# EAGLE schematic SPU_Rev_2.1 (EAGLE 9.6.2)

## Sheet 1 of 4: MCU
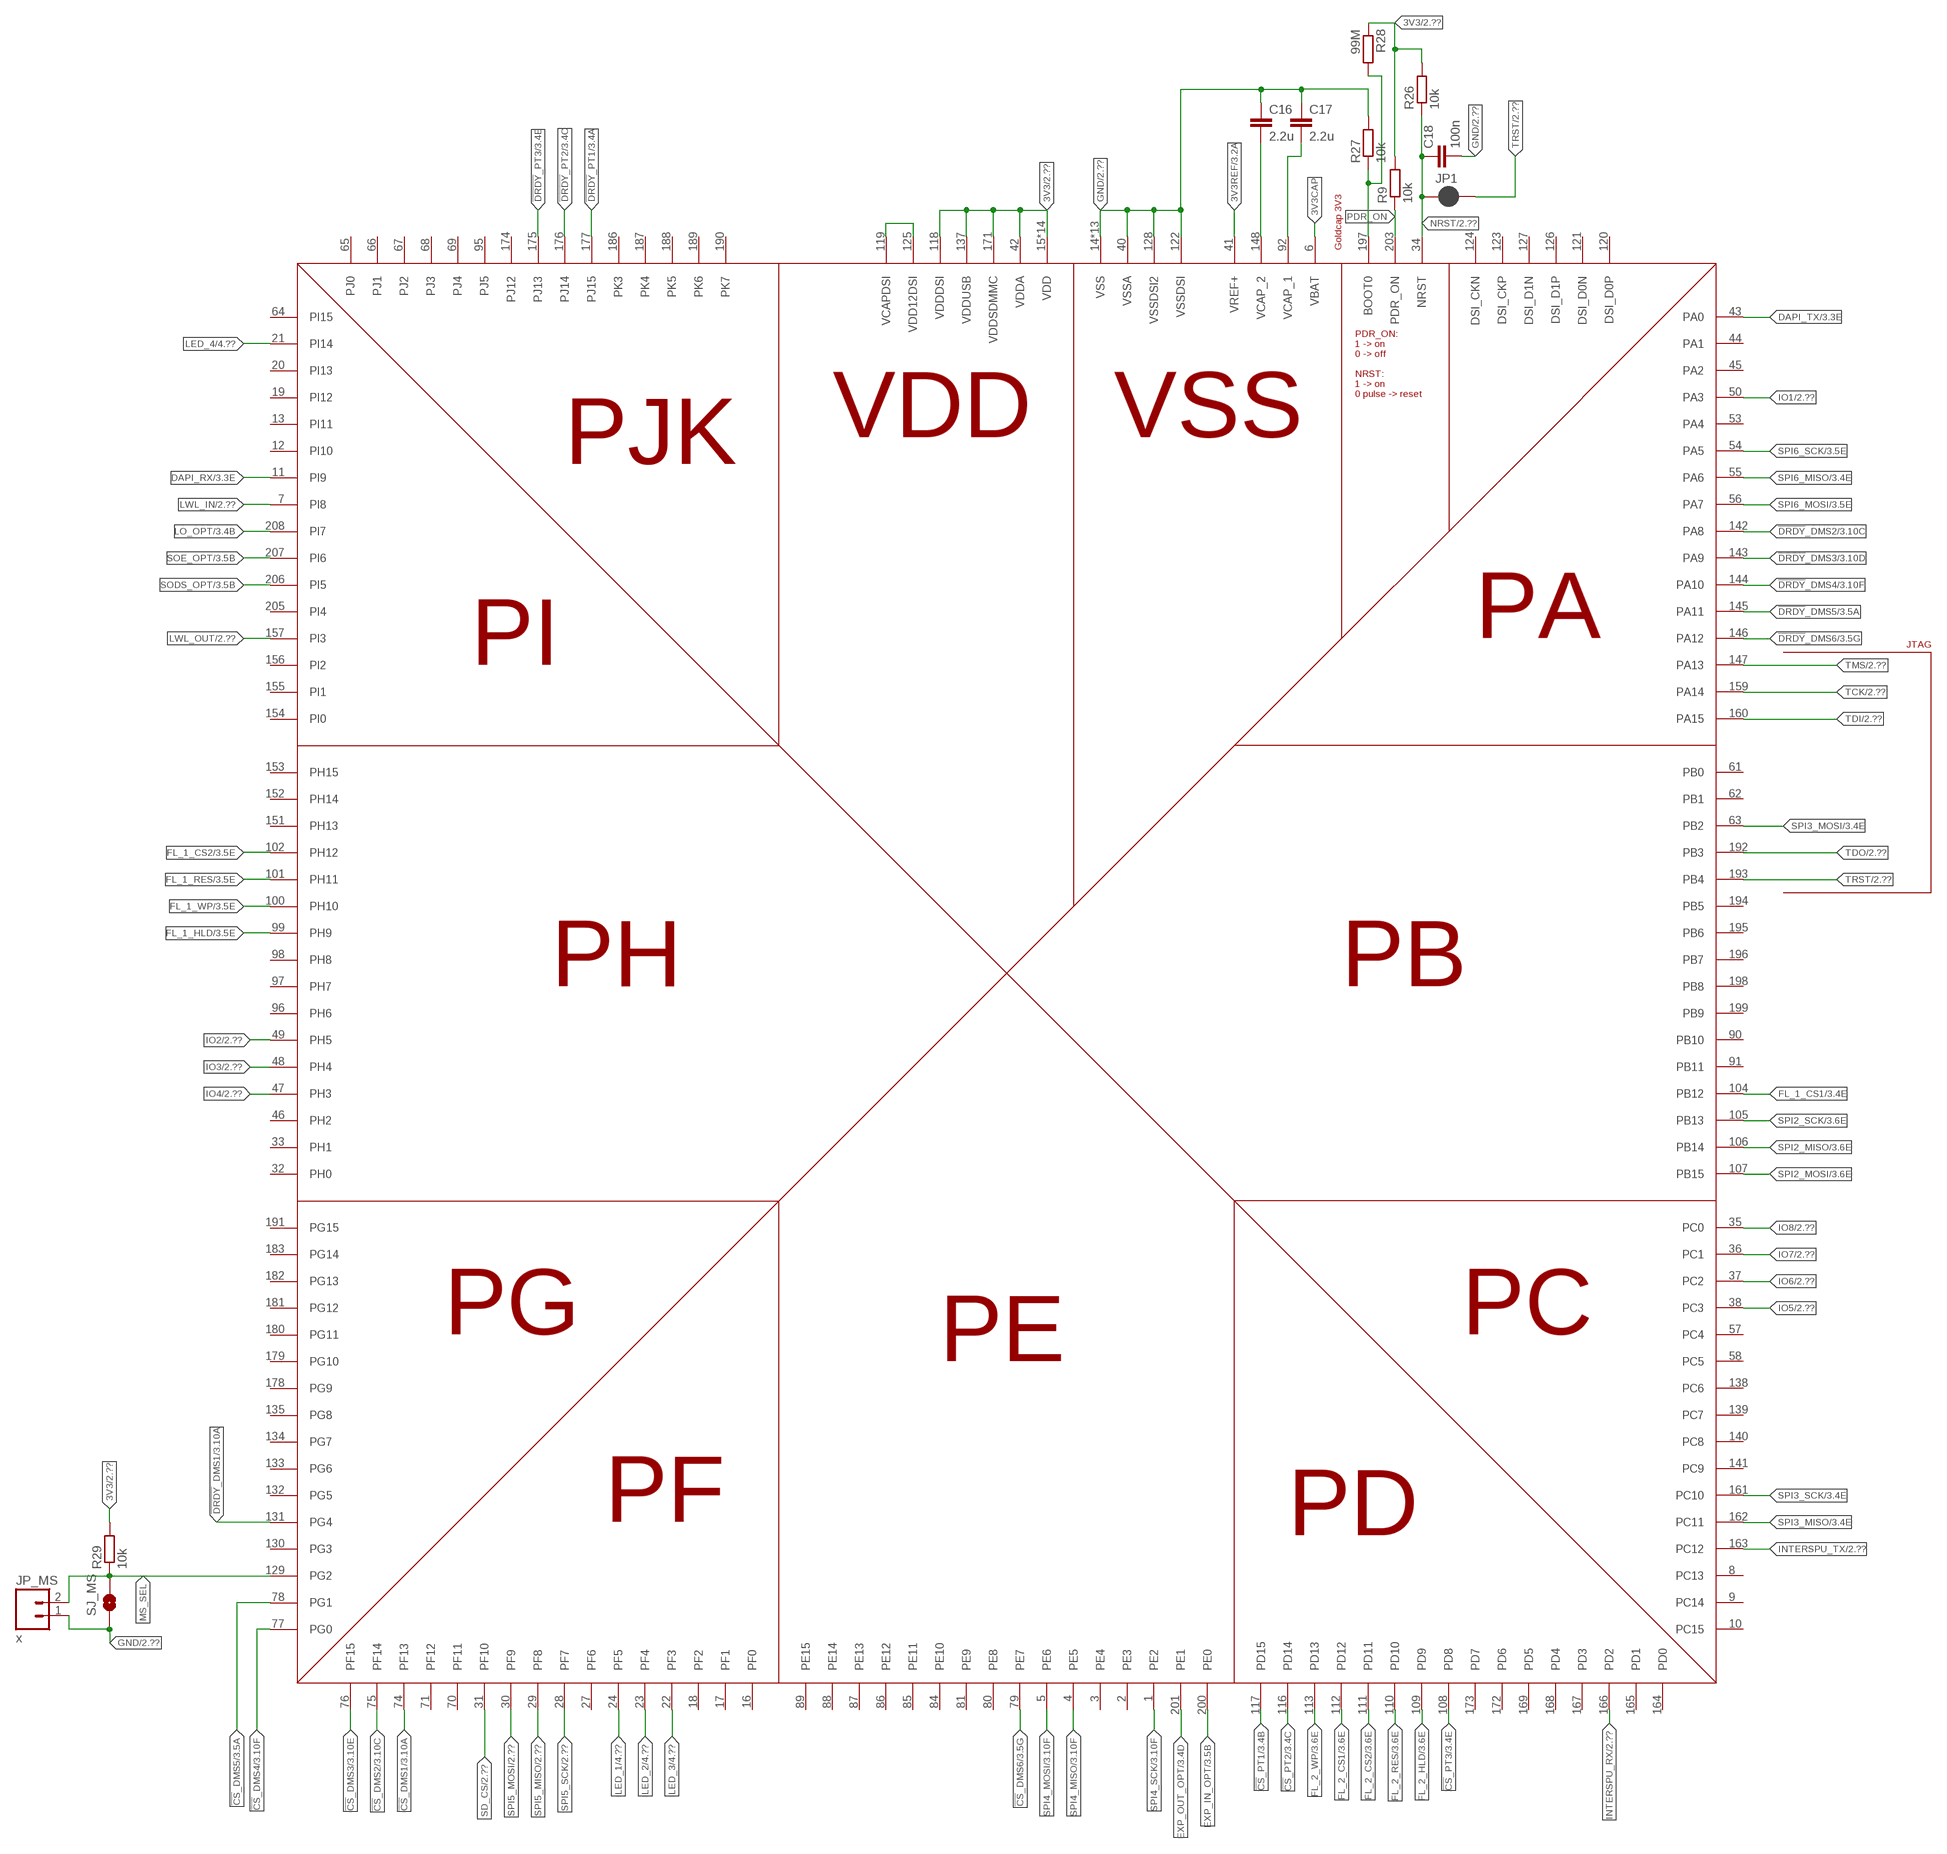
[diagram p0: schematic, sheet 1]

### Parts
C16  2.2u  C-EUC1206  [C1206]
C17  2.2u  C-EUC1206  [C1206]
C18  100n  CAP0603-CAP  [0603-CAP]
JP1  JUMPER-SMT_2_NC_PASTE_SILK  [SMT-JUMPER_2_NC_PASTE_SILK]
JP_MS  x  M02PTH  [1X02]
R9  10k  R-EU_R0805  [R0805]
R26  10k  R-EU_R0805  [R0805]
R27  10k  R-EU_R0805  [R0805]
R28  99M  R-EU_R0805  [R0805]
R29  10k  R-EU_R0805  [R0805]
SJ_MS  SOLDERJUMPERNO  [SJ_2S-NO]
U_STM32F779  STM32F77XXXLQFP208  [QFP50P3060X3060X385-208]

### Nets
3V3: R9.2 R26.2 R28.1 R29.2 U_STM32F779.15(VDD) U_STM32F779.26(VDD) U_STM32F779.39(VDD) U_STM32F779.42(VDDA) U_STM32F779.52(VDD) U_STM32F779.59(VDD) U_STM32F779.73(VDD) U_STM32F779.83(VDD) U_STM32F779.94(VDD) U_STM32F779.103(VDD) U_STM32F779.115(VDD) U_STM32F779.118(VDDDSI) U_STM32F779.137(VDDUSB) U_STM32F779.150(VDD) U_STM32F779.158(VDD) U_STM32F779.171(VDDSDMMC) U_STM32F779.185(VDD) U_STM32F779.204(VDD) ; also sheet 2,3,4
3V3CAP: U_STM32F779.6(VBAT)
3V3REF: U_STM32F779.41(VREF+) ; also sheet 3
!CS!_DMS1: U_STM32F779.74(PF13) ; also sheet 3
!CS!_DMS2: U_STM32F779.75(PF14) ; also sheet 3
!CS!_DMS3: U_STM32F779.76(PF15) ; also sheet 3
!CS!_DMS4: U_STM32F779.77(PG0) ; also sheet 3
!CS!_DMS5: U_STM32F779.78(PG1) ; also sheet 3
!CS!_DMS6: U_STM32F779.79(PE7) ; also sheet 3
!CS!_PT1: U_STM32F779.117(PD15) ; also sheet 3
!CS!_PT2: U_STM32F779.116(PD14) ; also sheet 3
!CS!_PT3: U_STM32F779.108(PD8) ; also sheet 3
!DRDY!_DMS1: U_STM32F779.131(PG4) ; also sheet 3
!DRDY!_DMS2: U_STM32F779.142(PA8) ; also sheet 3
!DRDY!_DMS3: U_STM32F779.143(PA9) ; also sheet 3
!DRDY!_DMS4: U_STM32F779.144(PA10) ; also sheet 3
!DRDY!_DMS5: U_STM32F779.145(PA11) ; also sheet 3
!DRDY!_DMS6: U_STM32F779.146(PA12) ; also sheet 3
!DRDY!_PT1: U_STM32F779.177(PJ15) ; also sheet 3
!DRDY!_PT2: U_STM32F779.176(PJ14) ; also sheet 3
!DRDY!_PT3: U_STM32F779.175(PJ13) ; also sheet 3
DAPI_RX: U_STM32F779.11(PI9) ; also sheet 3
DAPI_TX: U_STM32F779.43(PA0) ; also sheet 3
EXP_IN_OPT: U_STM32F779.200(PE0) ; also sheet 3
EXP_OUT_OPT: U_STM32F779.201(PE1) ; also sheet 3
FL_1_CS1: U_STM32F779.104(PB12) ; also sheet 3
FL_1_CS2: U_STM32F779.102(PH12) ; also sheet 3
FL_1_HLD: U_STM32F779.99(PH9) ; also sheet 3
FL_1_RES: U_STM32F779.101(PH11) ; also sheet 3
FL_1_WP: U_STM32F779.100(PH10) ; also sheet 3
FL_2_CS1: U_STM32F779.112(PD12) ; also sheet 3
FL_2_CS2: U_STM32F779.111(PD11) ; also sheet 3
FL_2_HLD: U_STM32F779.109(PD9) ; also sheet 3
FL_2_RES: U_STM32F779.110(PD10) ; also sheet 3
FL_2_WP: U_STM32F779.113(PD13) ; also sheet 3
GND: C16.1 C17.1 C18.2 JP_MS.1 R27.2 SJ_MS.1 U_STM32F779.14(VSS) U_STM32F779.25(VSS) U_STM32F779.40(VSSA) U_STM32F779.51(VSS) U_STM32F779.60(VSS) U_STM32F779.72(VSS) U_STM32F779.82(VSS) U_STM32F779.93(VSS) U_STM32F779.114(VSS) U_STM32F779.122(VSSDSI) U_STM32F779.128(VSSDSI2) U_STM32F779.136(VSS) U_STM32F779.149(VSS) U_STM32F779.170(VSS) U_STM32F779.184(VSS) U_STM32F779.202(VSS) ; also sheet 2,3,4
INTERSPU_RX: U_STM32F779.166(PD2) ; also sheet 2,3
INTERSPU_TX: U_STM32F779.163(PC12) ; also sheet 2,3
IO1: U_STM32F779.50(PA3) ; also sheet 2
IO2: U_STM32F779.49(PH5) ; also sheet 2
IO3: U_STM32F779.48(PH4) ; also sheet 2
IO4: U_STM32F779.47(PH3) ; also sheet 2
IO5: U_STM32F779.38(PC3) ; also sheet 2
IO6: U_STM32F779.37(PC2) ; also sheet 2
IO7: U_STM32F779.36(PC1) ; also sheet 2
IO8: U_STM32F779.35(PC0) ; also sheet 2
LED_1: U_STM32F779.24(PF5) ; also sheet 4
LED_2: U_STM32F779.23(PF4) ; also sheet 4
LED_3: U_STM32F779.22(PF3) ; also sheet 4
LED_4: U_STM32F779.21(PI14) ; also sheet 4
LO_OPT: U_STM32F779.208(PI7) ; also sheet 3
LWL_IN: U_STM32F779.7(PI8) ; also sheet 2
LWL_OUT: U_STM32F779.157(PI3) ; also sheet 2
MS_SEL: JP_MS.2 R29.1 SJ_MS.2 U_STM32F779.129(PG2)
N$34: C16.2 U_STM32F779.148(VCAP_2)
N$35: C17.2 U_STM32F779.92(VCAP_1)
N$36: U_STM32F779.119(VCAPDSI) U_STM32F779.125(VDD12DSI)
N$71: R27.1 R28.2 U_STM32F779.197(BOOT0)
NRST: C18.1 JP1.1 R26.1 U_STM32F779.34(NRST) ; also sheet 2
PDR_ON: R9.1 U_STM32F779.203(PDR_ON)
SD_CS: U_STM32F779.31(PF10) ; also sheet 2
SODS_OPT: U_STM32F779.206(PI5) ; also sheet 3
SOE_OPT: U_STM32F779.207(PI6) ; also sheet 3
SPI2_MISO: U_STM32F779.106(PB14) ; also sheet 3
SPI2_MOSI: U_STM32F779.107(PB15) ; also sheet 3
SPI2_SCK: U_STM32F779.105(PB13) ; also sheet 3
SPI3_MISO: U_STM32F779.162(PC11) ; also sheet 3
SPI3_MOSI: U_STM32F779.63(PB2) ; also sheet 3
SPI3_SCK: U_STM32F779.161(PC10) ; also sheet 3
SPI4_MISO: U_STM32F779.4(PE5) ; also sheet 3
SPI4_MOSI: U_STM32F779.5(PE6) ; also sheet 3
SPI4_SCK: U_STM32F779.1(PE2) ; also sheet 3
SPI5_MISO: U_STM32F779.29(PF8) ; also sheet 2
SPI5_MOSI: U_STM32F779.30(PF9) ; also sheet 2
SPI5_SCK: U_STM32F779.28(PF7) ; also sheet 2
SPI6_MISO: U_STM32F779.55(PA6) ; also sheet 3
SPI6_MOSI: U_STM32F779.56(PA7) ; also sheet 3
SPI6_SCK: U_STM32F779.54(PA5) ; also sheet 3
TCK: U_STM32F779.159(PA14) ; also sheet 2
TDI: U_STM32F779.160(PA15) ; also sheet 2
TDO: U_STM32F779.192(PB3) ; also sheet 2
TMS: U_STM32F779.147(PA13) ; also sheet 2
TRST: JP1.2 U_STM32F779.193(PB4) ; also sheet 2
Unconnected: U_STM32F779.2(PE3) U_STM32F779.3(PE4) U_STM32F779.8(PC13) U_STM32F779.9(PC14) U_STM32F779.10(PC15) U_STM32F779.12(PI10) U_STM32F779.13(PI11) U_STM32F779.16(PF0) U_STM32F779.17(PF1) U_STM32F779.18(PF2) U_STM32F779.19(PI12) U_STM32F779.20(PI13) U_STM32F779.27(PF6) U_STM32F779.32(PH0) U_STM32F779.33(PH1) U_STM32F779.44(PA1) U_STM32F779.45(PA2) U_STM32F779.46(PH2) U_STM32F779.53(PA4) U_STM32F779.57(PC4) U_STM32F779.58(PC5) U_STM32F779.61(PB0) U_STM32F779.62(PB1) U_STM32F779.64(PI15) U_STM32F779.65(PJ0) U_STM32F779.66(PJ1) U_STM32F779.67(PJ2) U_STM32F779.68(PJ3) U_STM32F779.69(PJ4) U_STM32F779.70(PF11) U_STM32F779.71(PF12) U_STM32F779.80(PE8) U_STM32F779.81(PE9) U_STM32F779.84(PE10) U_STM32F779.85(PE11) U_STM32F779.86(PE12) U_STM32F779.87(PE13) U_STM32F779.88(PE14) U_STM32F779.89(PE15) U_STM32F779.90(PB10) U_STM32F779.91(PB11) U_STM32F779.95(PJ5) U_STM32F779.96(PH6) U_STM32F779.97(PH7) U_STM32F779.98(PH8) U_STM32F779.120(DSI_D0P) U_STM32F779.121(DSI_D0N) U_STM32F779.123(DSI_CKP) U_STM32F779.124(DSI_CKN) U_STM32F779.126(DSI_D1P) U_STM32F779.127(DSI_D1N) U_STM32F779.130(PG3) U_STM32F779.132(PG5) U_STM32F779.133(PG6) U_STM32F779.134(PG7) U_STM32F779.135(PG8) U_STM32F779.138(PC6) U_STM32F779.139(PC7) U_STM32F779.140(PC8) U_STM32F779.141(PC9) U_STM32F779.151(PH13) U_STM32F779.152(PH14) U_STM32F779.153(PH15) U_STM32F779.154(PI0) U_STM32F779.155(PI1) U_STM32F779.156(PI2) U_STM32F779.164(PD0) U_STM32F779.165(PD1) U_STM32F779.167(PD3) U_STM32F779.168(PD4) U_STM32F779.169(PD5) U_STM32F779.172(PD6) U_STM32F779.173(PD7) U_STM32F779.174(PJ12) U_STM32F779.178(PG9) U_STM32F779.179(PG10) U_STM32F779.180(PG11) U_STM32F779.181(PG12) U_STM32F779.182(PG13) U_STM32F779.183(PG14) U_STM32F779.186(PK3) U_STM32F779.187(PK4) U_STM32F779.188(PK5) U_STM32F779.189(PK6) U_STM32F779.190(PK7) U_STM32F779.191(PG15) U_STM32F779.194(PB5) U_STM32F779.195(PB6) U_STM32F779.196(PB7) U_STM32F779.198(PB8) U_STM32F779.199(PB9) U_STM32F779.205(PI4)

### Notes on the sheet
- Goldcap 3V3
- PDR_ON:
  1 -> on
  0 -> off
  
  NRST:
  1 -> on
  0 pulse -> reset
- JTAG

## Sheet 2 of 4: Connectors
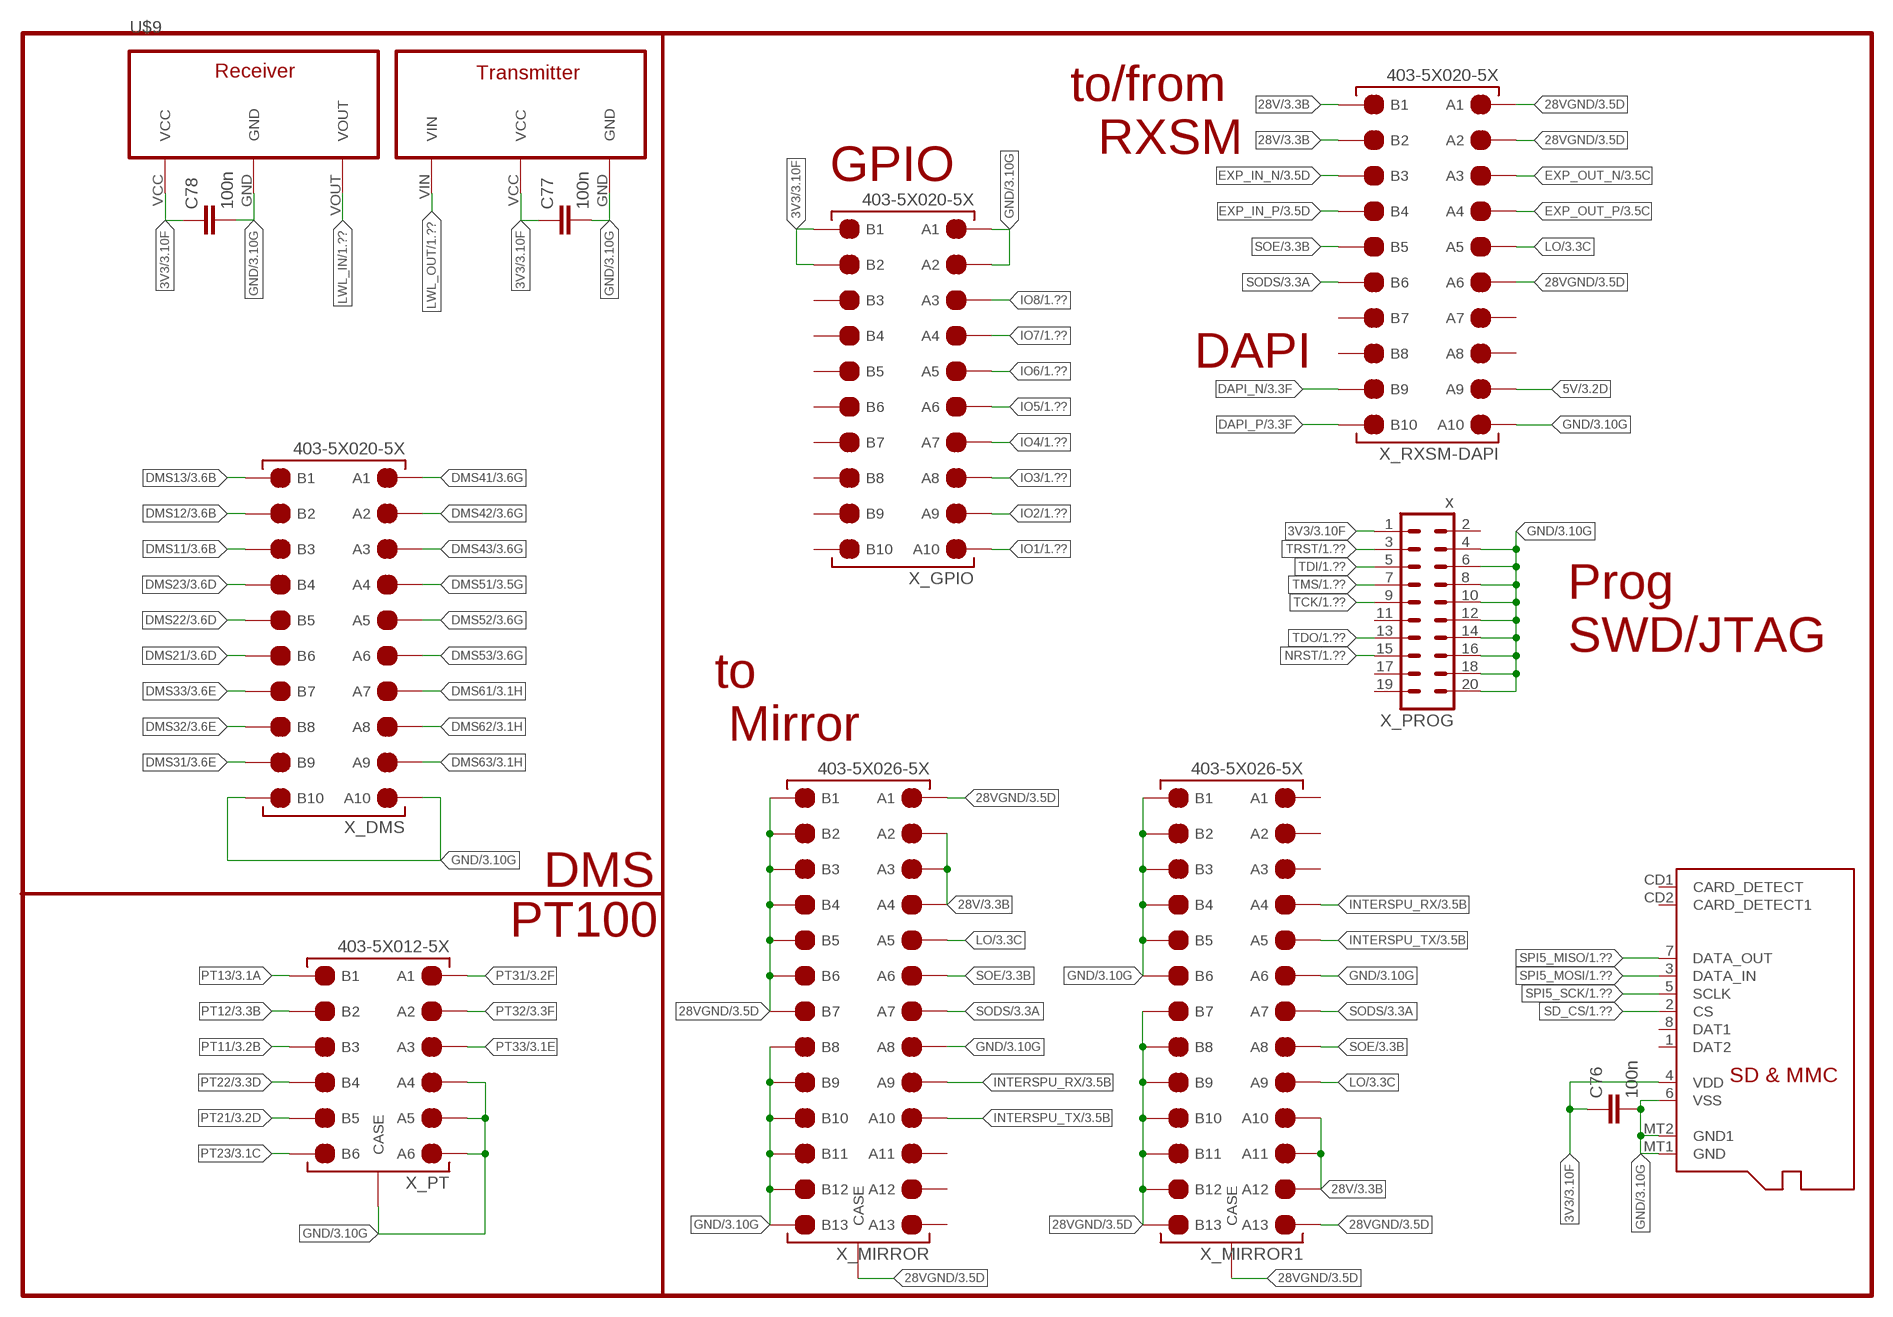
[diagram p1: schematic, sheet 2]

### Parts
C76  100n  CAP0603-CAP  [0603-CAP]
C77  100n  C-EUC1206  [C1206]
C78  100n  C-EUC1206  [C1206]
U$7  MICROSD  [MICROSD]
U$8  PLT131PLT131-T1  [PLT131-T1]
U$9  PLR135  [PLR135-T1]
X_DMS  403-5X020-5X  [403-5X020-5X]
X_GPIO  403-5X020-5X  [403-5X020-5X]
X_MIRROR  403-5X026-5X  [403-5X026-5X]
X_MIRROR1  403-5X026-5X  [403-5X026-5X]
X_PROG  x  MA10-2  [MA10-2]
X_PT  403-5X012-5X  [403-5X012-5X]
X_RXSM-DAPI  403-5X020-5X  [403-5X020-5X]

### Nets
3V3: C76.1 C77.1 C78.1 U$7.4(VDD) U$8.VCC U$9.VCC X_GPIO.P$B1(B1) X_GPIO.P$B2(B2) X_PROG.1 ; also sheet 1,3,4
5V: X_RXSM-DAPI.P$A9(A9) ; also sheet 3,4
28V: X_MIRROR1.P$A10(A10) X_MIRROR1.P$A11(A11) X_MIRROR1.P$A12(A12) X_MIRROR.P$A2(A2) X_MIRROR.P$A3(A3) X_MIRROR.P$A4(A4) X_RXSM-DAPI.P$B1(B1) X_RXSM-DAPI.P$B2(B2) ; also sheet 3,4
28VGND: X_MIRROR1.P$A13(A13) X_MIRROR1.P$B7(B7) X_MIRROR1.P$B8(B8) X_MIRROR1.P$B9(B9) X_MIRROR1.P$B10(B10) X_MIRROR1.P$B11(B11) X_MIRROR1.P$B12(B12) X_MIRROR1.P$B13(B13) X_MIRROR1.P$BL1(CASE) X_MIRROR1.P$BL2(CASE) X_MIRROR1.P$BL3(CASE) X_MIRROR1.P$BL4(CASE) X_MIRROR.P$A1(A1) X_MIRROR.P$B1(B1) X_MIRROR.P$B2(B2) X_MIRROR.P$B3(B3) X_MIRROR.P$B4(B4) X_MIRROR.P$B5(B5) X_MIRROR.P$B6(B6) X_MIRROR.P$B7(B7) X_MIRROR.P$BL1(CASE) X_MIRROR.P$BL2(CASE) X_MIRROR.P$BL3(CASE) X_MIRROR.P$BL4(CASE) X_RXSM-DAPI.P$A1(A1) X_RXSM-DAPI.P$A2(A2) X_RXSM-DAPI.P$A6(A6) ; also sheet 3,4
DAPI_N: X_RXSM-DAPI.P$B9(B9) ; also sheet 3
DAPI_P: X_RXSM-DAPI.P$B10(B10) ; also sheet 3
DMS11: X_DMS.P$B3(B3) ; also sheet 3
DMS12: X_DMS.P$B2(B2) ; also sheet 3
DMS13: X_DMS.P$B1(B1) ; also sheet 3
DMS21: X_DMS.P$B6(B6) ; also sheet 3
DMS22: X_DMS.P$B5(B5) ; also sheet 3
DMS23: X_DMS.P$B4(B4) ; also sheet 3
DMS31: X_DMS.P$B9(B9) ; also sheet 3
DMS32: X_DMS.P$B8(B8) ; also sheet 3
DMS33: X_DMS.P$B7(B7) ; also sheet 3
DMS41: X_DMS.P$A1(A1) ; also sheet 3
DMS42: X_DMS.P$A2(A2) ; also sheet 3
DMS43: X_DMS.P$A3(A3) ; also sheet 3
DMS51: X_DMS.P$A4(A4) ; also sheet 3
DMS52: X_DMS.P$A5(A5) ; also sheet 3
DMS53: X_DMS.P$A6(A6) ; also sheet 3
DMS61: X_DMS.P$A7(A7) ; also sheet 3
DMS62: X_DMS.P$A8(A8) ; also sheet 3
DMS63: X_DMS.P$A9(A9) ; also sheet 3
EXP_IN_N: X_RXSM-DAPI.P$B3(B3) ; also sheet 3
EXP_IN_P: X_RXSM-DAPI.P$B4(B4) ; also sheet 3
EXP_OUT_N: X_RXSM-DAPI.P$A3(A3) ; also sheet 3
EXP_OUT_P: X_RXSM-DAPI.P$A4(A4) ; also sheet 3
GND: C76.2 C77.2 C78.2 U$7.6(VSS) U$7.MT1(GND) U$7.MT2(GND1) U$8.GND U$9.GND X_DMS.P$A10(A10) X_DMS.P$B10(B10) X_GPIO.P$A1(A1) X_GPIO.P$A2(A2) X_MIRROR1.P$A6(A6) X_MIRROR1.P$B1(B1) X_MIRROR1.P$B2(B2) X_MIRROR1.P$B3(B3) X_MIRROR1.P$B4(B4) X_MIRROR1.P$B5(B5) X_MIRROR1.P$B6(B6) X_MIRROR.P$A8(A8) X_MIRROR.P$B8(B8) X_MIRROR.P$B9(B9) X_MIRROR.P$B10(B10) X_MIRROR.P$B11(B11) X_MIRROR.P$B12(B12) X_MIRROR.P$B13(B13) X_PROG.4 X_PROG.6 X_PROG.8 X_PROG.10 X_PROG.12 X_PROG.14 X_PROG.16 X_PROG.18 X_PROG.20 X_PT.P$A4(A4) X_PT.P$A5(A5) X_PT.P$A6(A6) X_PT.P$BL1(CASE) X_PT.P$BL2(CASE) X_PT.P$BL3(CASE) X_PT.P$BL4(CASE) X_RXSM-DAPI.P$A10(A10) ; also sheet 1,3,4
INTERSPU_RX: X_MIRROR1.P$A4(A4) X_MIRROR.P$A9(A9) ; also sheet 1,3
INTERSPU_TX: X_MIRROR1.P$A5(A5) X_MIRROR.P$A10(A10) ; also sheet 1,3
IO1: X_GPIO.P$A10(A10) ; also sheet 1
IO2: X_GPIO.P$A9(A9) ; also sheet 1
IO3: X_GPIO.P$A8(A8) ; also sheet 1
IO4: X_GPIO.P$A7(A7) ; also sheet 1
IO5: X_GPIO.P$A6(A6) ; also sheet 1
IO6: X_GPIO.P$A5(A5) ; also sheet 1
IO7: X_GPIO.P$A4(A4) ; also sheet 1
IO8: X_GPIO.P$A3(A3) ; also sheet 1
LO: X_MIRROR1.P$A9(A9) X_MIRROR.P$A5(A5) X_RXSM-DAPI.P$A5(A5) ; also sheet 3
LWL_IN: U$9.VOUT ; also sheet 1
LWL_OUT: U$8.VIN ; also sheet 1
NRST: X_PROG.15 ; also sheet 1
PT11: X_PT.P$B3(B3) ; also sheet 3
PT12: X_PT.P$B2(B2) ; also sheet 3
PT13: X_PT.P$B1(B1) ; also sheet 3
PT21: X_PT.P$B5(B5) ; also sheet 3
PT22: X_PT.P$B4(B4) ; also sheet 3
PT23: X_PT.P$B6(B6) ; also sheet 3
PT31: X_PT.P$A1(A1) ; also sheet 3
PT32: X_PT.P$A2(A2) ; also sheet 3
PT33: X_PT.P$A3(A3) ; also sheet 3
SD_CS: U$7.2(CS) ; also sheet 1
SODS: X_MIRROR1.P$A7(A7) X_MIRROR.P$A7(A7) X_RXSM-DAPI.P$B6(B6) ; also sheet 3
SOE: X_MIRROR1.P$A8(A8) X_MIRROR.P$A6(A6) X_RXSM-DAPI.P$B5(B5) ; also sheet 3
SPI5_MISO: U$7.7(DATA_OUT) ; also sheet 1
SPI5_MOSI: U$7.3(DATA_IN) ; also sheet 1
SPI5_SCK: U$7.5(SCLK) ; also sheet 1
TCK: X_PROG.9 ; also sheet 1
TDI: X_PROG.5 ; also sheet 1
TDO: X_PROG.13 ; also sheet 1
TMS: X_PROG.7 ; also sheet 1
TRST: X_PROG.3 ; also sheet 1
Unconnected: U$7.1(DAT2) U$7.8(DAT1) U$7.CD1(CARD_DETECT) U$7.CD2(CARD_DETECT1) X_GPIO.P$B3(B3) X_GPIO.P$B4(B4) X_GPIO.P$B5(B5) X_GPIO.P$B6(B6) X_GPIO.P$B7(B7) X_GPIO.P$B8(B8) X_GPIO.P$B9(B9) X_GPIO.P$B10(B10) X_MIRROR1.P$A1(A1) X_MIRROR1.P$A2(A2) X_MIRROR1.P$A3(A3) X_MIRROR.P$A11(A11) X_MIRROR.P$A12(A12) X_MIRROR.P$A13(A13) X_PROG.2 X_PROG.11 X_PROG.17 X_PROG.19 X_RXSM-DAPI.P$A7(A7) X_RXSM-DAPI.P$A8(A8) X_RXSM-DAPI.P$B7(B7) X_RXSM-DAPI.P$B8(B8)

### Notes on the sheet
- to/from
    RXSM
- GPIO
- DAPI
- Prog
  SWD/JTAG
- to 
   Mirror
- DMS
- PT100

## Sheet 3 of 4: IC
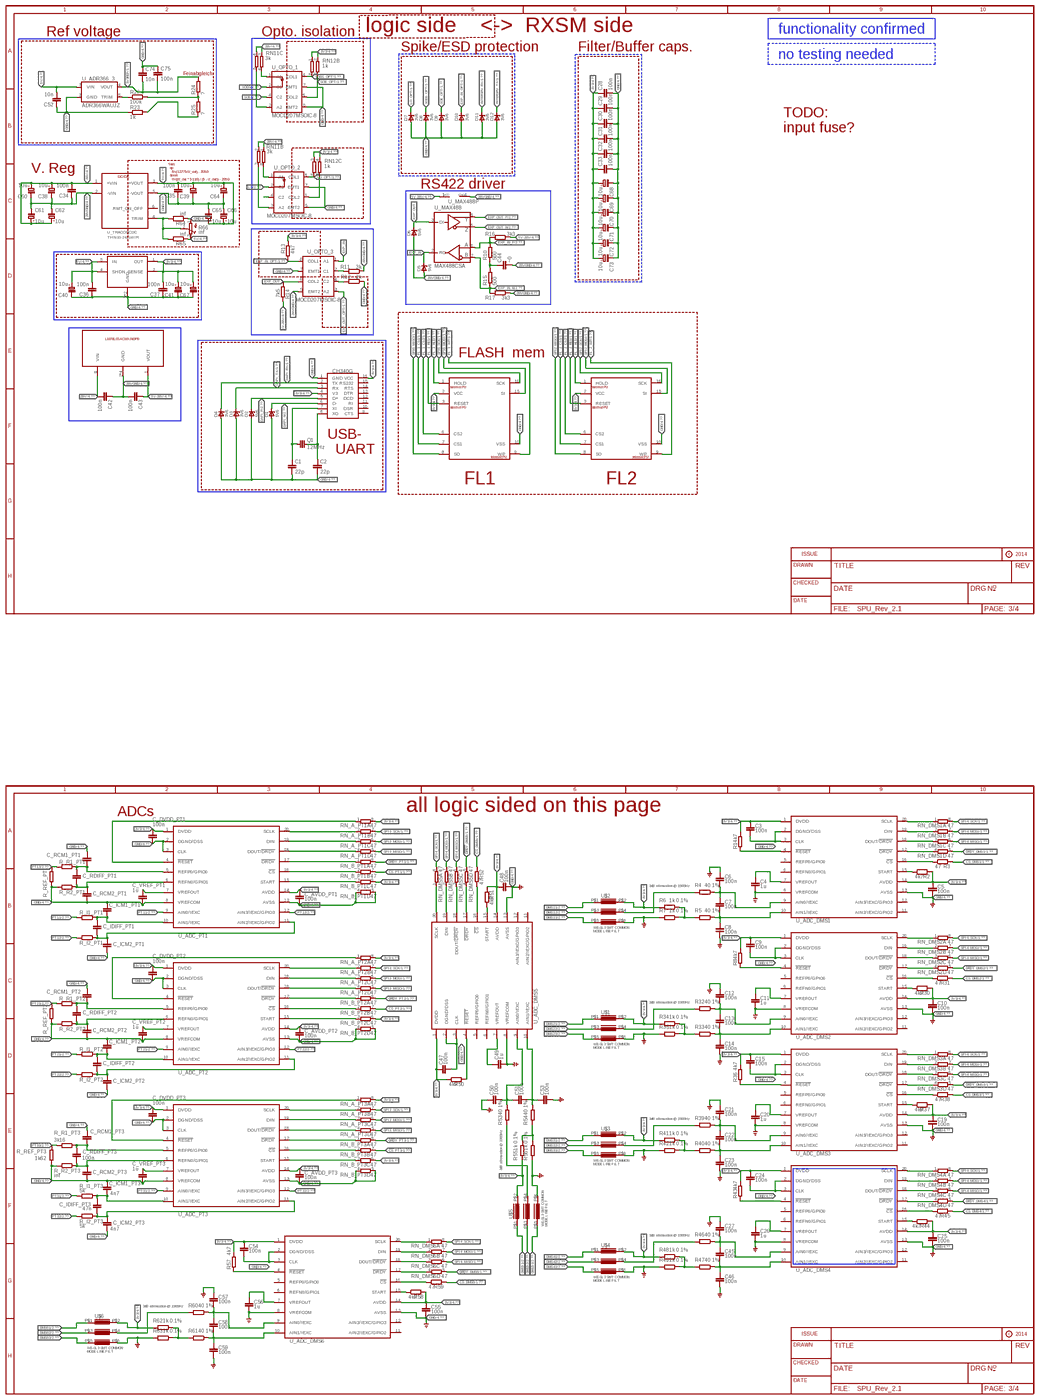
[diagram p2: schematic, sheet 3, overview]
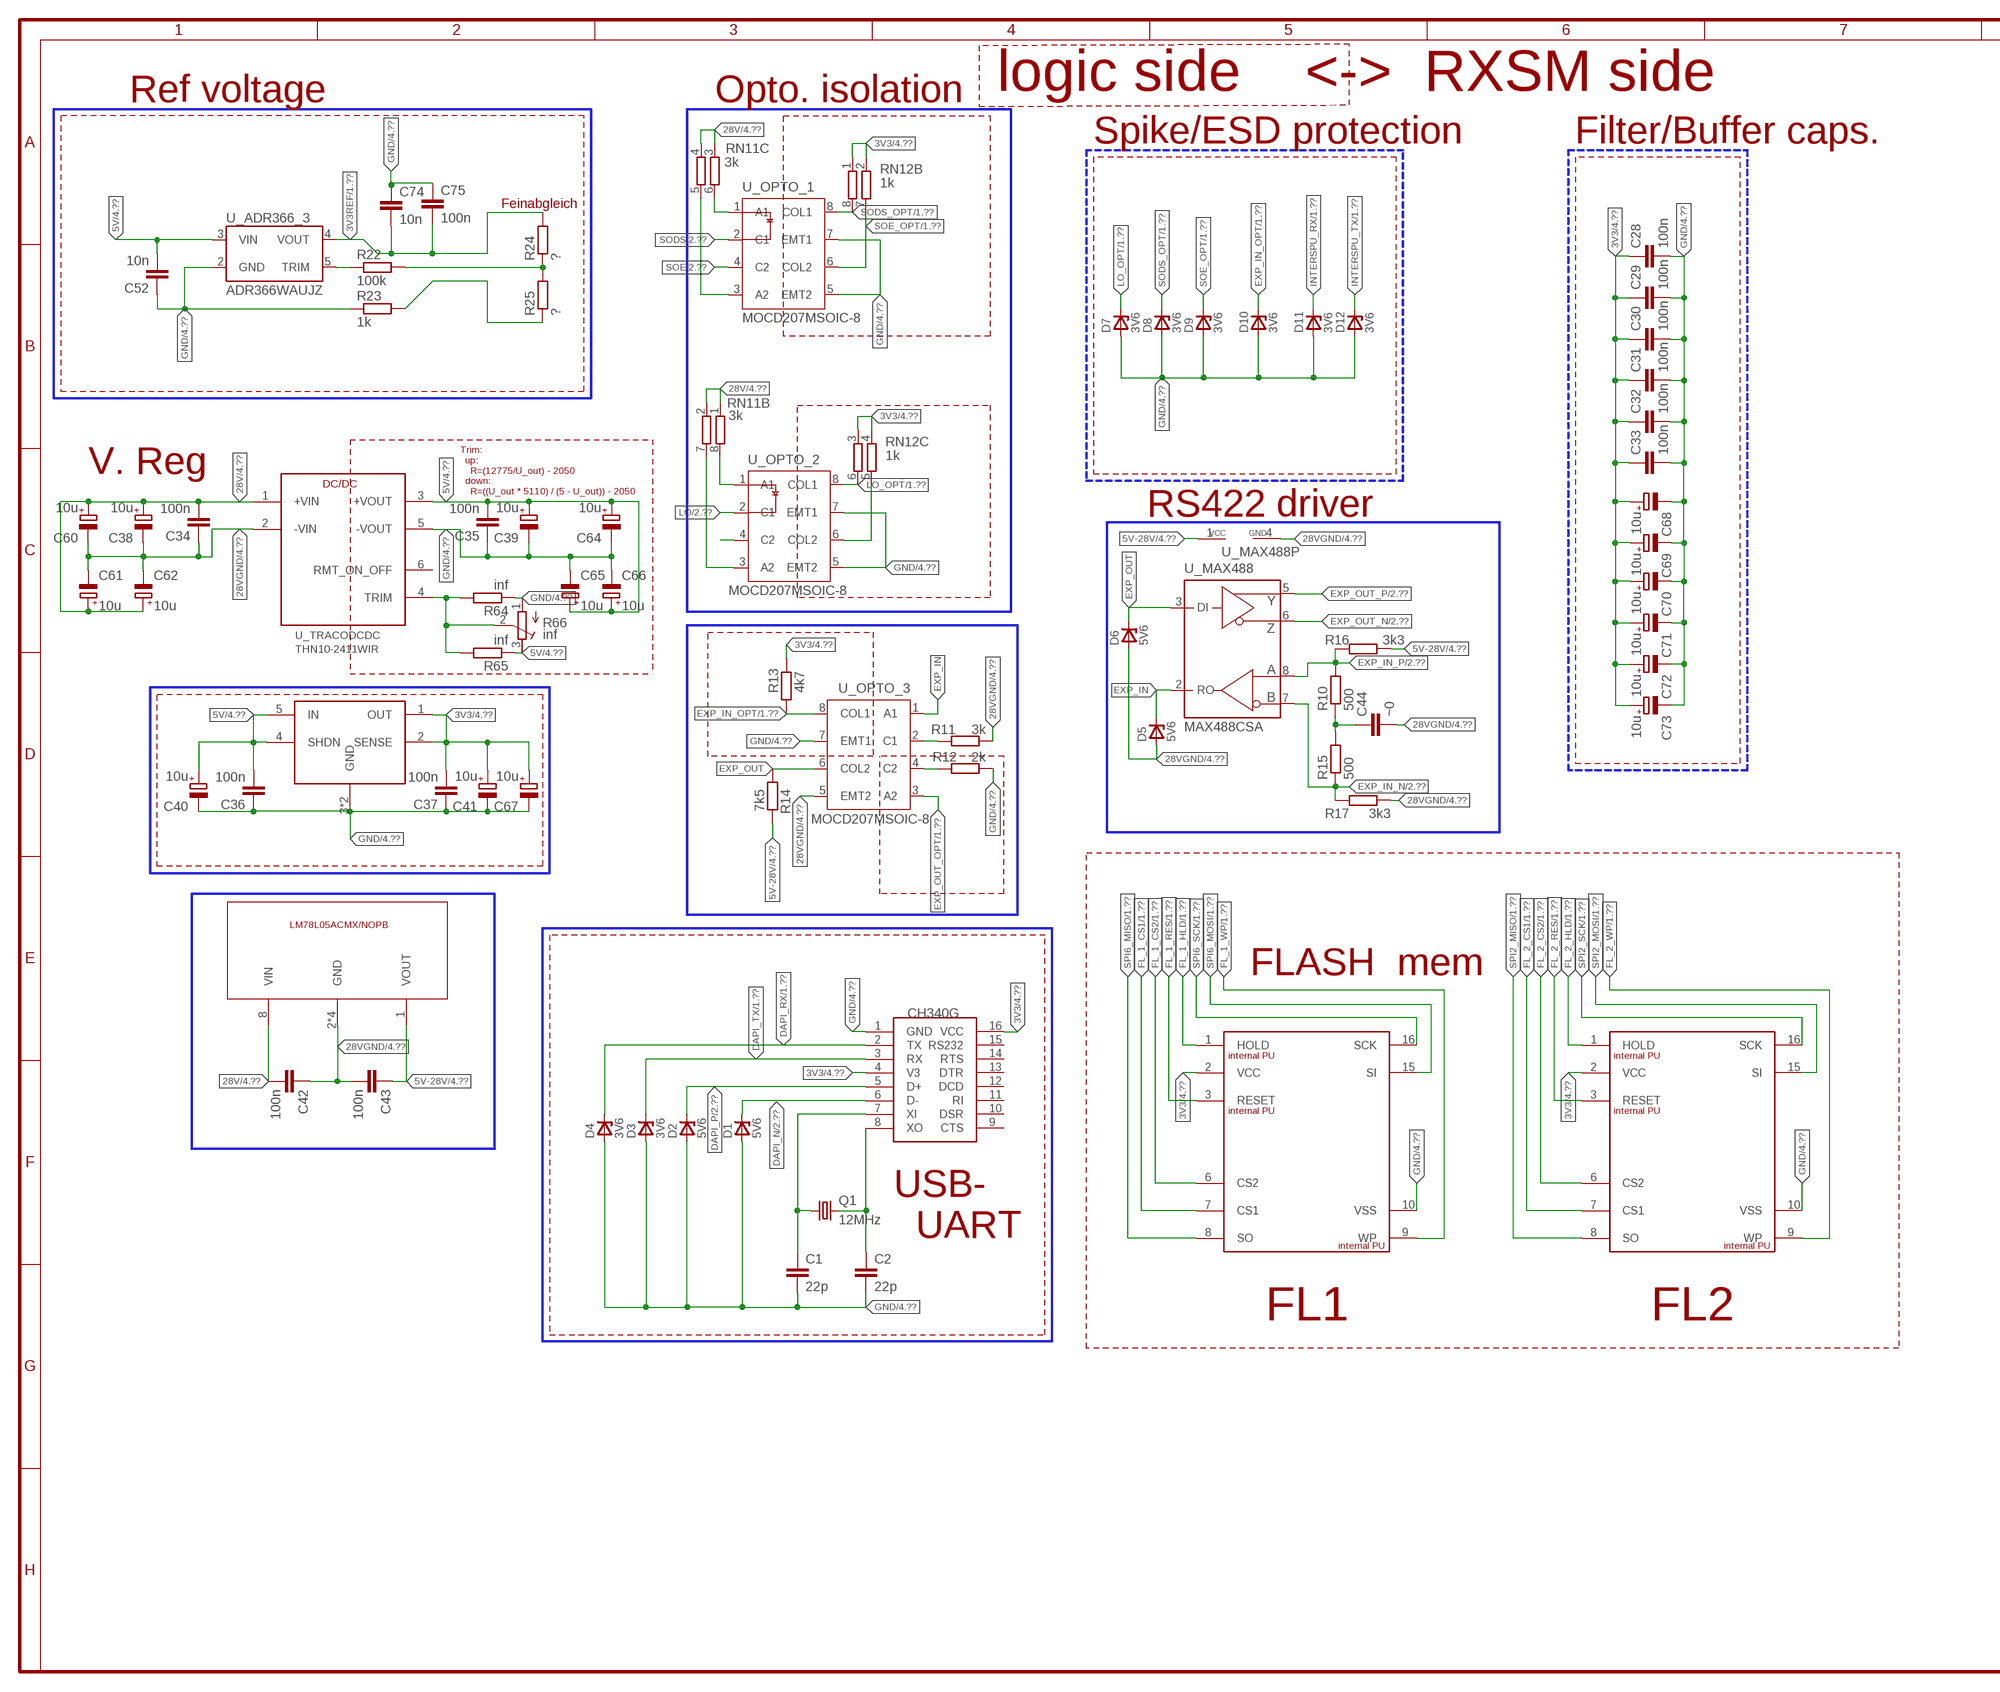
[diagram p3: schematic, sheet 3, part 1 of 4]
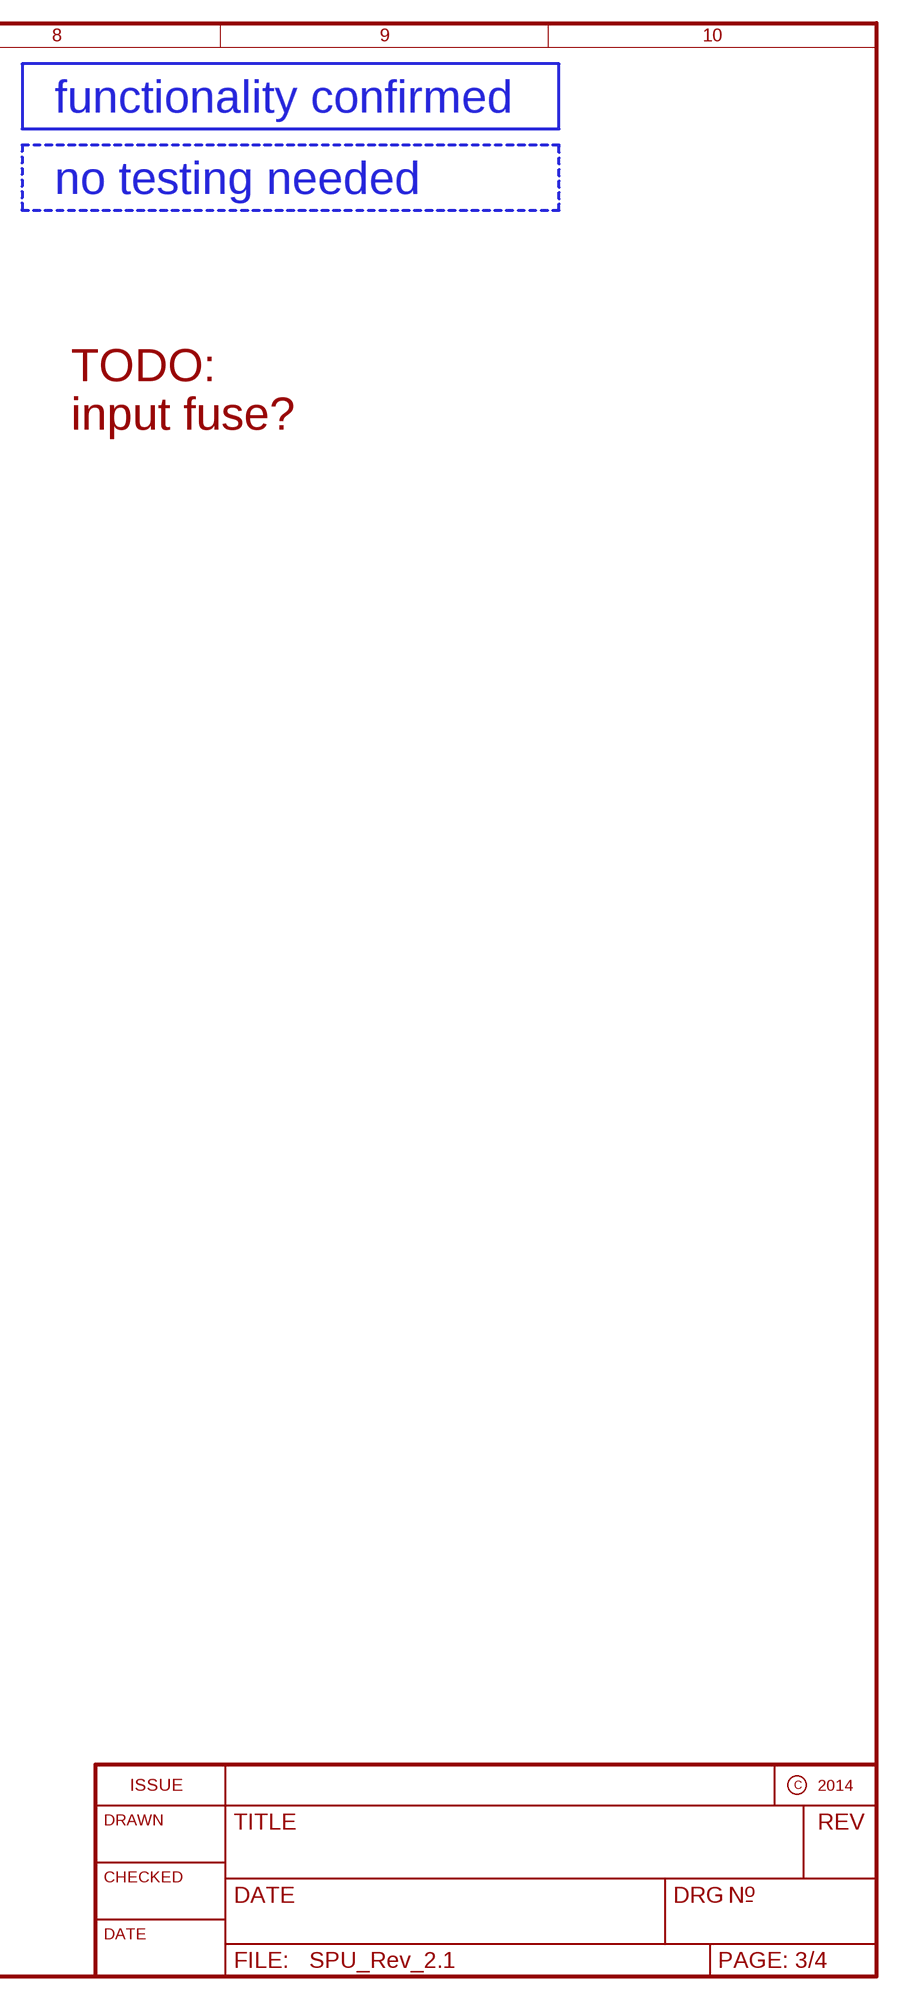
[diagram p4: schematic, sheet 3, part 2 of 4]
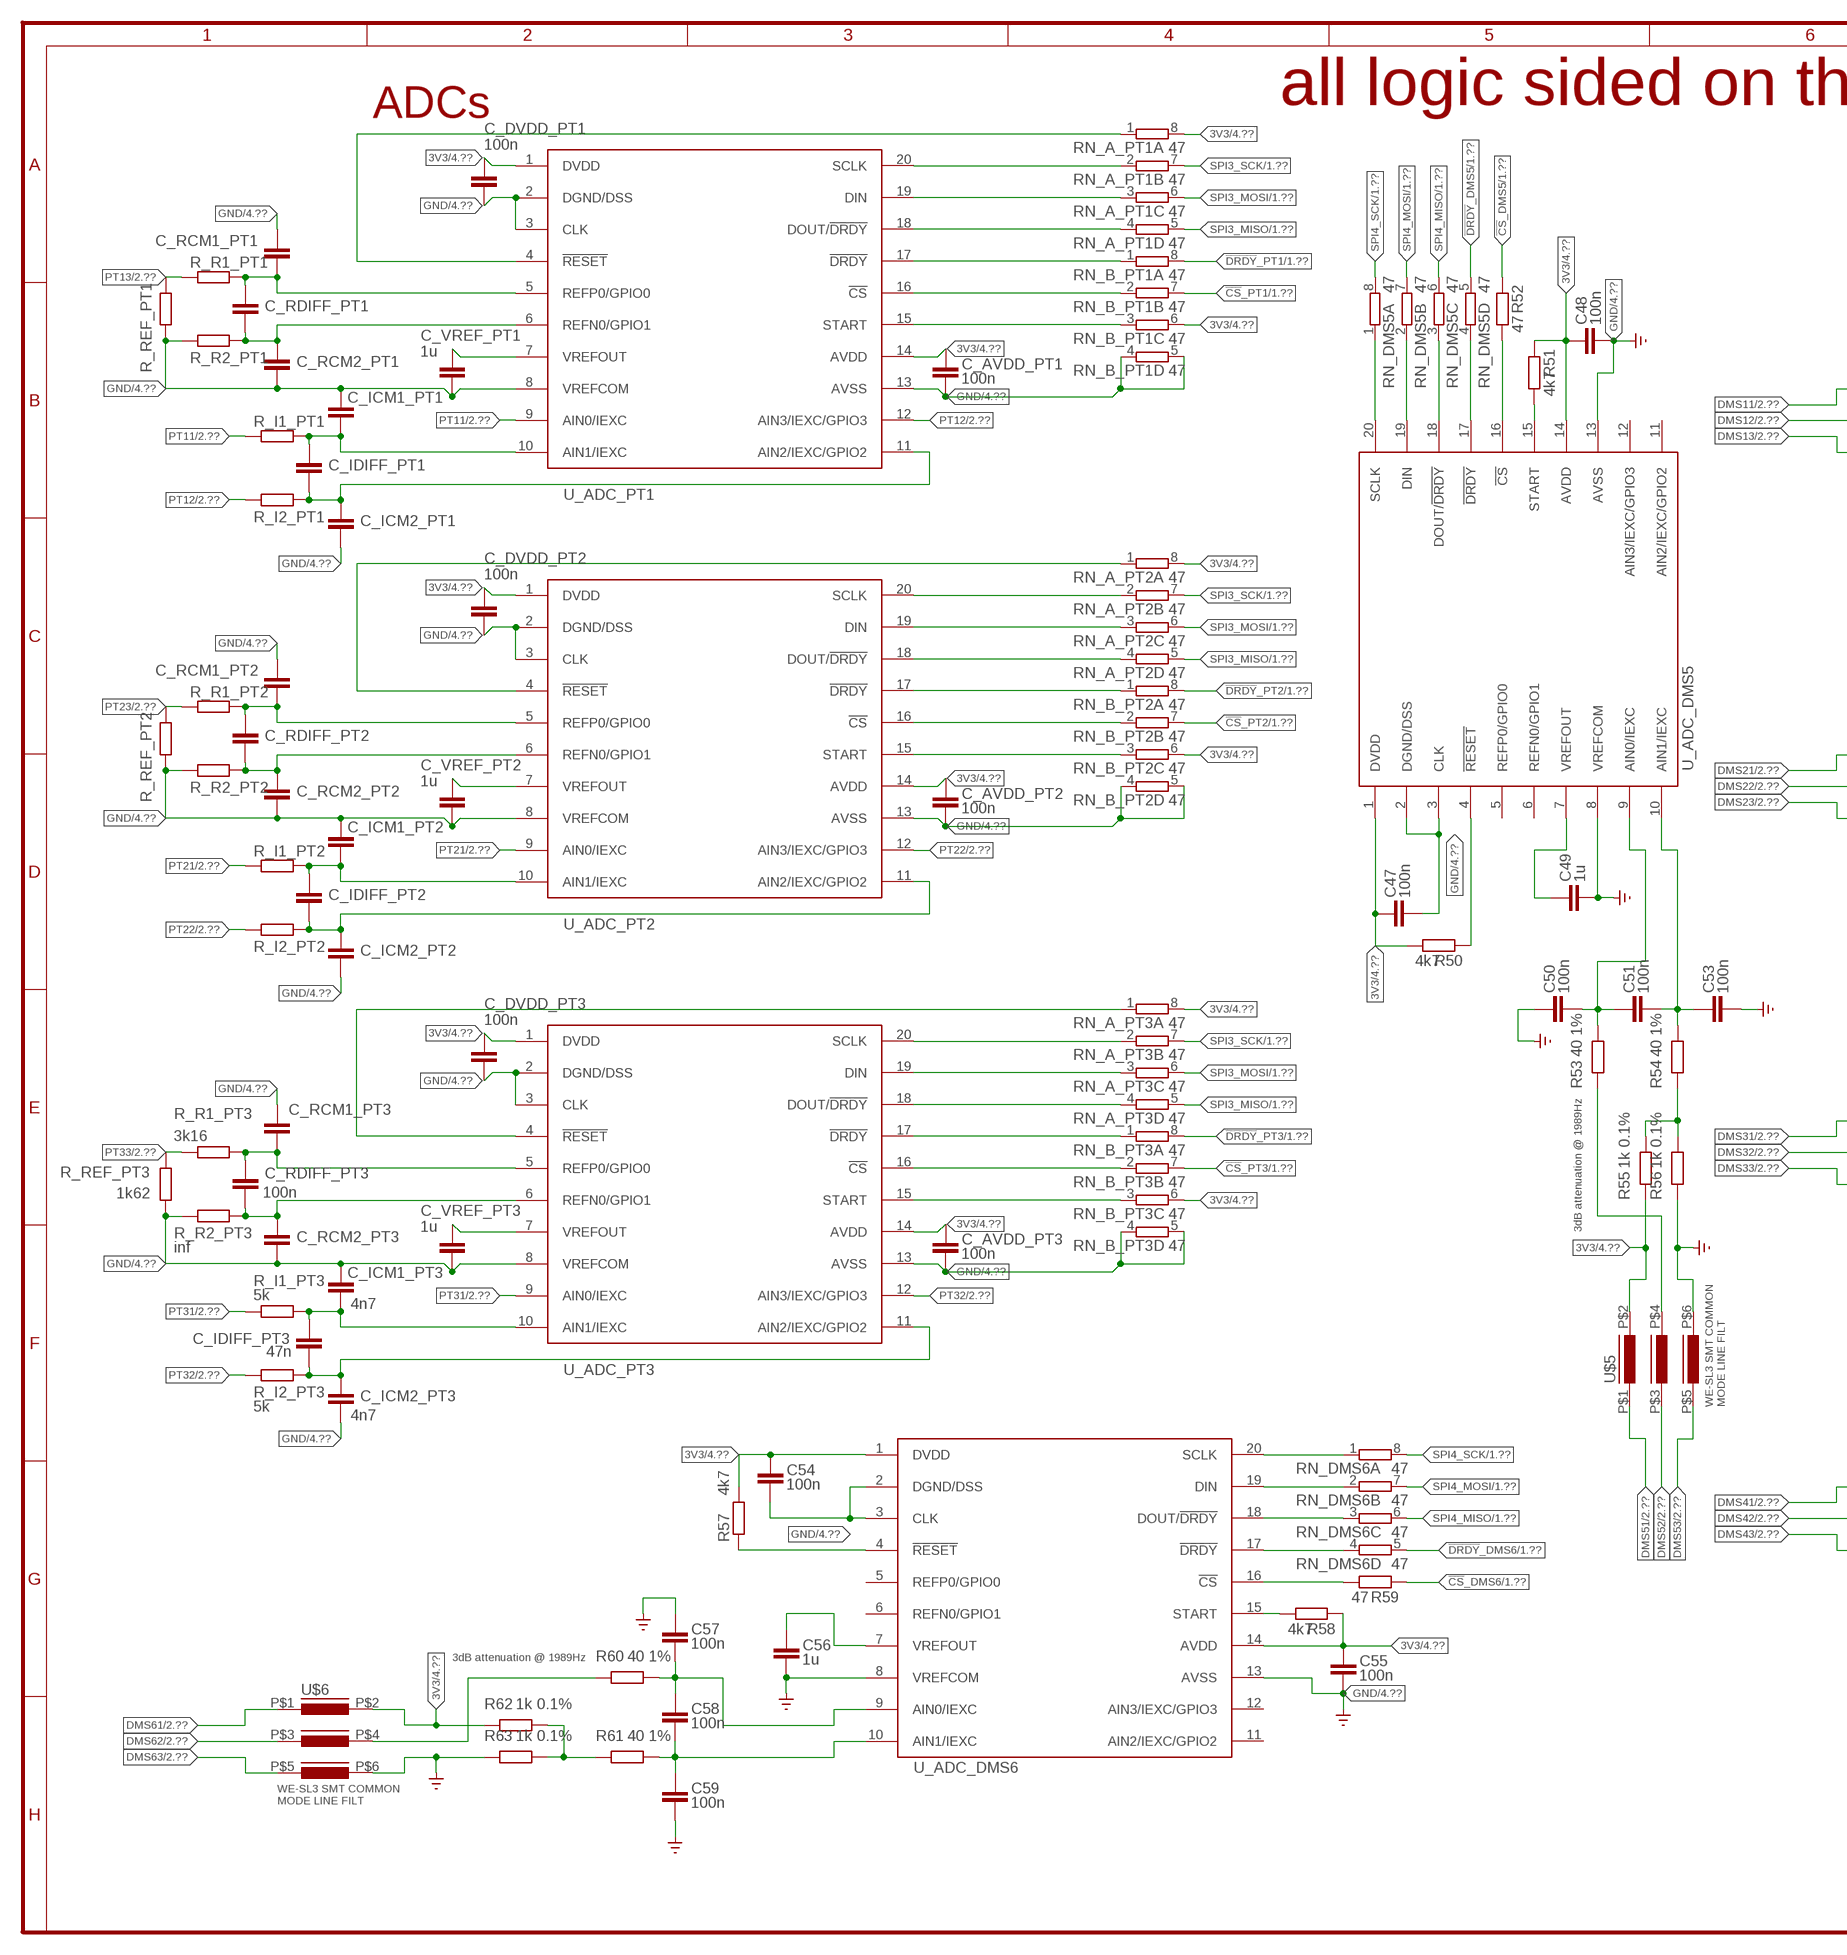
[diagram p5: schematic, sheet 3, part 3 of 4]
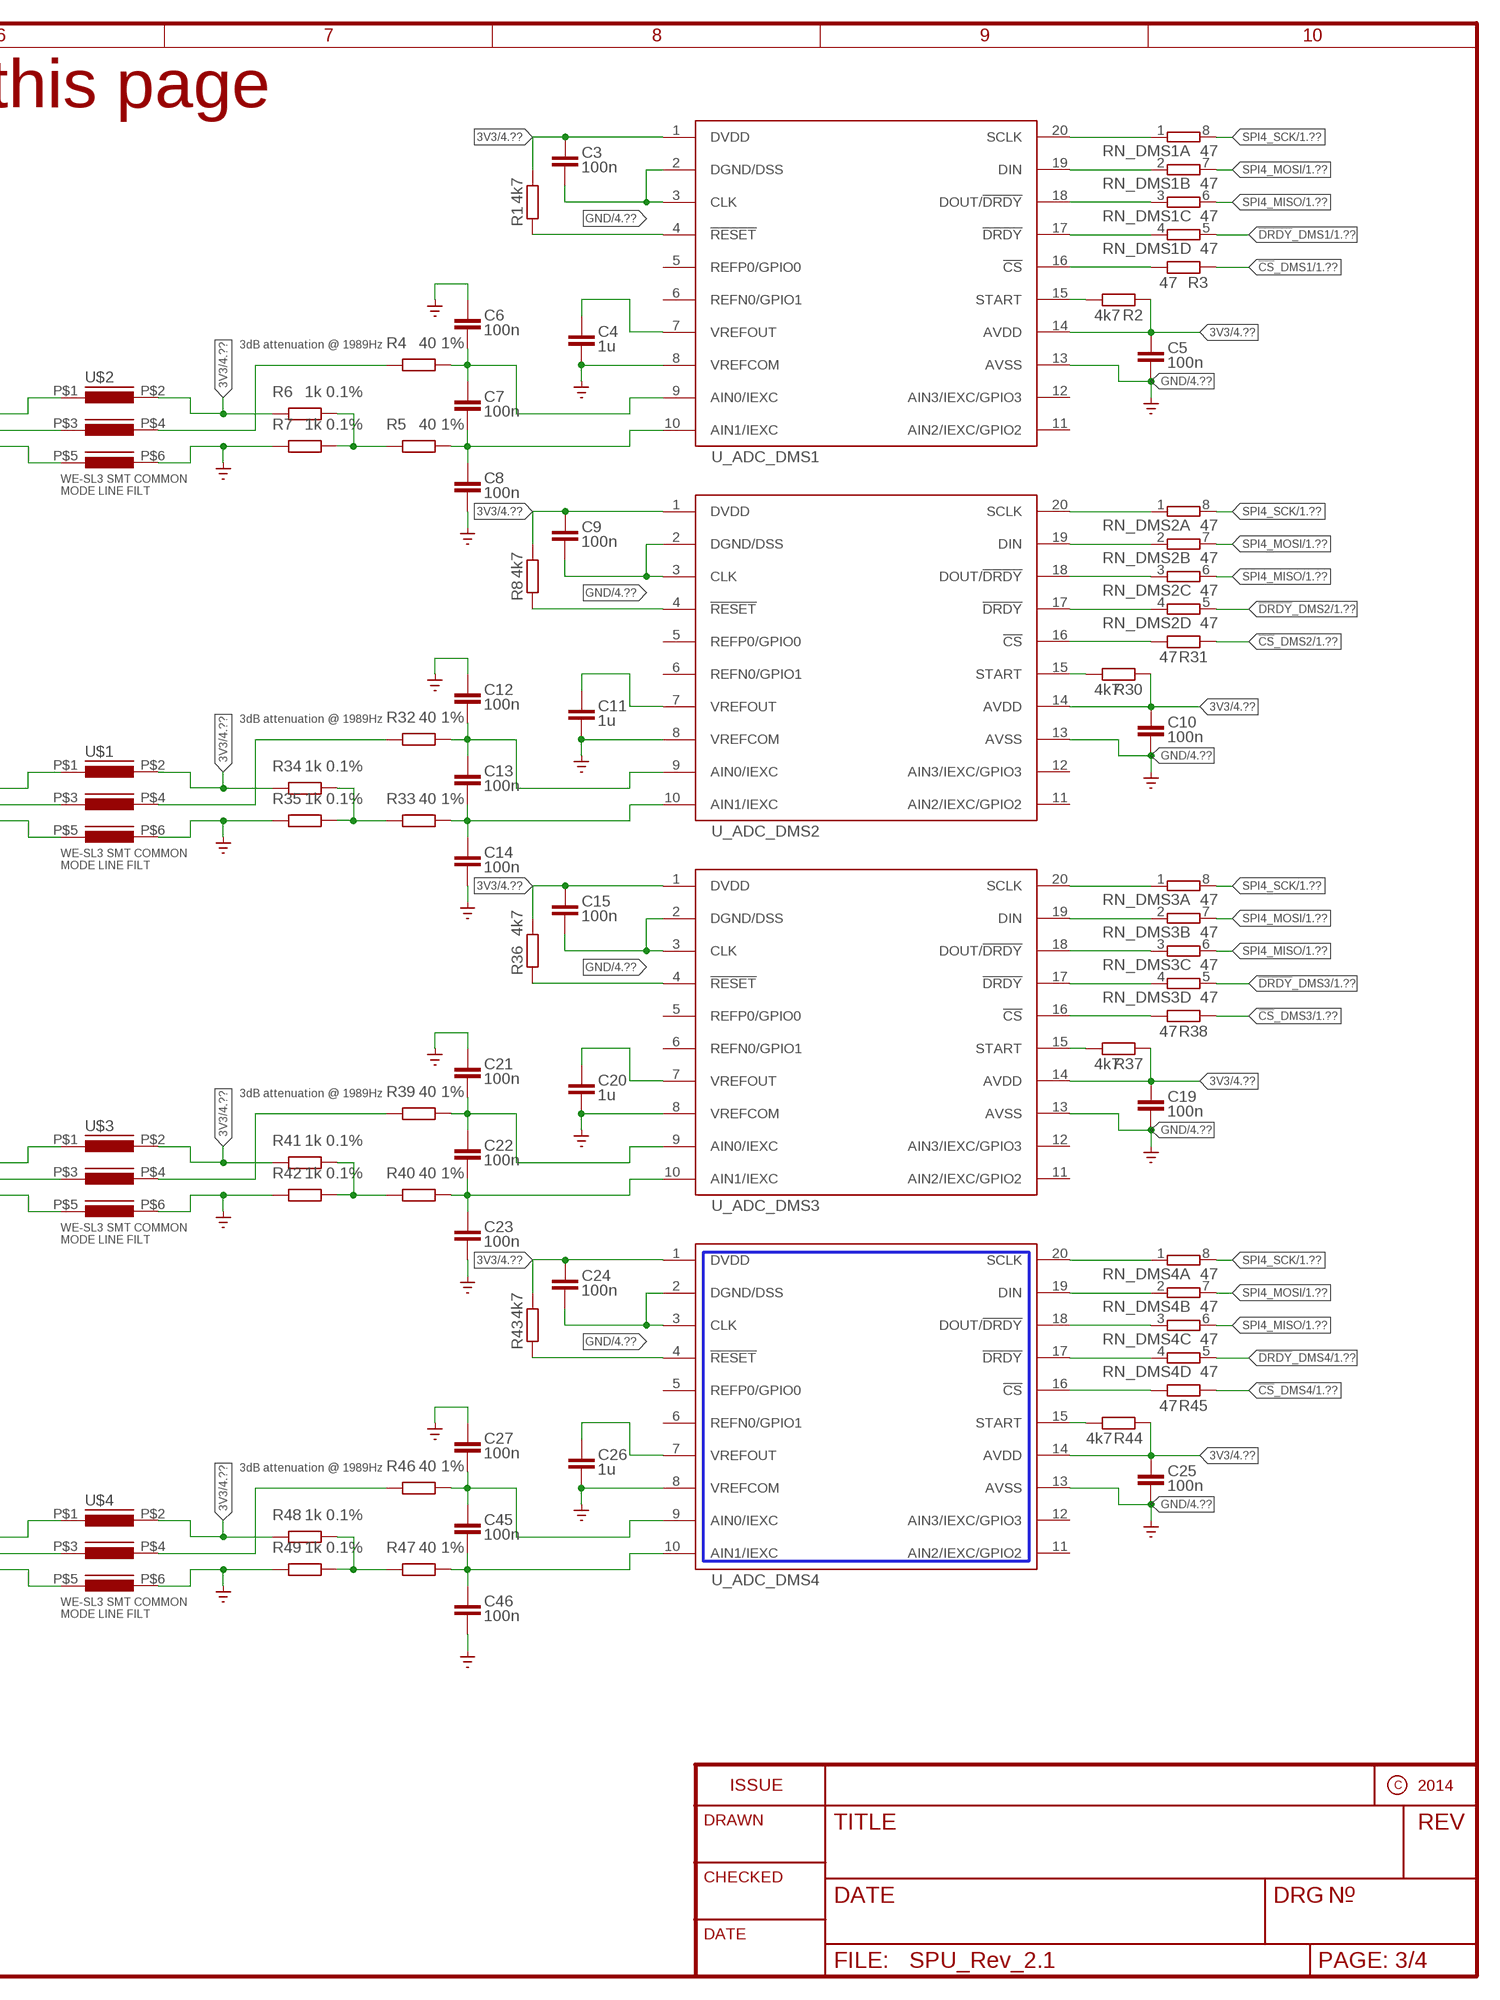
[diagram p6: schematic, sheet 3, part 4 of 4]

### Parts
C1  22p  C-EUC0603  [C0603]
C2  22p  C-EUC0603  [C0603]
C3  100n  C-EUC0603  [C0603]
C4  1u  C-EUC1206  [C1206]
C5  100n  C-EUC0603  [C0603]
C6  100n  C-EUC0603  [C0603]
C7  100n  C-EUC0603  [C0603]
C8  100n  C-EUC0603  [C0603]
C9  100n  C-EUC0603  [C0603]
C10  100n  C-EUC0603  [C0603]
C11  1u  C-EUC1206  [C1206]
C12  100n  C-EUC0603  [C0603]
C13  100n  C-EUC0603  [C0603]
C14  100n  C-EUC0603  [C0603]
C15  100n  C-EUC0603  [C0603]
C19  100n  C-EUC0603  [C0603]
C20  1u  C-EUC1206  [C1206]
C21  100n  C-EUC0603  [C0603]
C22  100n  C-EUC0603  [C0603]
C23  100n  C-EUC0603  [C0603]
C24  100n  C-EUC0603  [C0603]
C25  100n  C-EUC0603  [C0603]
C26  1u  C-EUC1206  [C1206]
C27  100n  C-EUC0603  [C0603]
C28  100n  C-EUC0805  [C0805]
C29  100n  C-EUC0805  [C0805]
C30  100n  C-EUC0805  [C0805]
C31  100n  C-EUC0805  [C0805]
C32  100n  C-EUC0805  [C0805]
C33  100n  C-EUC0805  [C0805]
C34  100n  C-EUC0805  [C0805]
C35  100n  C-EUC0805  [C0805]
C36  100n  C-EUC0805  [C0805]
C37  100n  C-EUC0805  [C0805]
C38  10u  CPOL-EUE/7260-38W  [E/7260-38W]
C39  10u  CPOL-EUE/7260-38W  [E/7260-38W]
C40  10u  CPOL-EUE/7260-38W  [E/7260-38W]
C41  10u  CPOL-EUE/7260-38W  [E/7260-38W]
C42  100n  C-EUC0805  [C0805]
C43  100n  C-EUC0805  [C0805]
C44  ~0  C-EUC0805  [C0805]
C45  100n  C-EUC0603  [C0603]
C46  100n  C-EUC0603  [C0603]
C47  100n  C-EUC0603  [C0603]
C48  100n  C-EUC0603  [C0603]
C49  1u  C-EUC1206  [C1206]
C50  100n  C-EUC0603  [C0603]
C51  100n  C-EUC0603  [C0603]
C52  10n  C-EUC0805  [C0805]
C53  100n  C-EUC0603  [C0603]
C54  100n  C-EUC0603  [C0603]
C55  100n  C-EUC0603  [C0603]
C56  1u  C-EUC1206  [C1206]
C57  100n  C-EUC0603  [C0603]
C58  100n  C-EUC0603  [C0603]
C59  100n  C-EUC0603  [C0603]
C60  10u  CPOL-EUE/7260-38W  [E/7260-38W]
C61  10u  CPOL-EUE/7260-38W  [E/7260-38W]
C62  10u  CPOL-EUE/7260-38W  [E/7260-38W]
C64  10u  CPOL-EUE/7260-38W  [E/7260-38W]
C65  10u  CPOL-EUE/7260-38W  [E/7260-38W]
C66  10u  CPOL-EUE/7260-38W  [E/7260-38W]
C67  10u  CPOL-EUE/7260-38W  [E/7260-38W]
C68  10u  CPOL-EUE/7260-38W  [E/7260-38W]
C69  10u  CPOL-EUE/7260-38W  [E/7260-38W]
C70  10u  CPOL-EUE/7260-38W  [E/7260-38W]
C71  10u  CPOL-EUE/7260-38W  [E/7260-38W]
C72  10u  CPOL-EUE/7260-38W  [E/7260-38W]
C73  10u  CPOL-EUE/7260-38W  [E/7260-38W]
C74  10n  C-EUC0805  [C0805]
C75  100n  C-EUC0805  [C0805]
C_AVDD_PT1  100n  C-EUC0603  [C0603]
C_AVDD_PT2  100n  C-EUC0603  [C0603]
C_AVDD_PT3  100n  C-EUC0603  [C0603]
C_DVDD_PT1  100n  C-EUC0603  [C0603]
C_DVDD_PT2  100n  C-EUC0603  [C0603]
C_DVDD_PT3  100n  C-EUC0603  [C0603]
C_ICM1_PT1  C-EUC0603  [C0603]
C_ICM1_PT2  C-EUC0603  [C0603]
C_ICM1_PT3  4n7  C-EUC0603  [C0603]
C_ICM2_PT1  C-EUC0603  [C0603]
C_ICM2_PT2  C-EUC0603  [C0603]
C_ICM2_PT3  4n7  C-EUC0603  [C0603]
C_IDIFF_PT1  C-EUC0603  [C0603]
C_IDIFF_PT2  C-EUC0603  [C0603]
C_IDIFF_PT3  47n  C-EUC0603  [C0603]
C_RCM1_PT1  C-EUC0603  [C0603]
C_RCM1_PT2  C-EUC0603  [C0603]
C_RCM1_PT3  C-EUC0603  [C0603]
C_RCM2_PT1  C-EUC0603  [C0603]
C_RCM2_PT2  C-EUC0603  [C0603]
C_RCM2_PT3  C-EUC0603  [C0603]
C_RDIFF_PT1  C-EUC0603  [C0603]
C_RDIFF_PT2  C-EUC0603  [C0603]
C_RDIFF_PT3  100n  C-EUC0603  [C0603]
C_VREF_PT1  1u  C-EUC0603  [C0603]
C_VREF_PT2  1u  C-EUC0603  [C0603]
C_VREF_PT3  1u  C-EUC0603  [C0603]
D1  5V6  DZMELF  [DMELF]
D2  5V6  DZMELF  [DMELF]
D3  3V6  DZMELF  [DMELF]
D4  3V6  DZMELF  [DMELF]
D5  5V6  DZMELF  [DMELF]
D6  5V6  DZMELF  [DMELF]
D7  3V6  DZMELF  [DMELF]
D8  3V6  DZMELF  [DMELF]
D9  3V6  DZMELF  [DMELF]
D10  3V6  DZMELF  [DMELF]
D11  3V6  DZMELF  [DMELF]
D12  3V6  DZMELF  [DMELF]
Q1  12MHz  CRYSTALSM49  [SM49]
R1  4k7  R-EU_R0603  [R0603]
R2  4k7  R-EU_R0603  [R0603]
R3  47  R-EU_R0603  [R0603]
R4  40 1%  R-EU_R0805  [R0805]
R5  40 1%  R-EU_R0805  [R0805]
R6  1k 0.1%  R-EU_R0805  [R0805]
R7  1k 0.1%  R-EU_R0805  [R0805]
R8  4k7  R-EU_R0603  [R0603]
R10  500  R-EU_R0805  [R0805]
R11  3k  R-EU_R0805  [R0805]
R12  2k  R-EU_R0805  [R0805]
R13  4k7  R-EU_R0805  [R0805]
R14  7k5  R-EU_R0805  [R0805]
R15  500  R-EU_R0805  [R0805]
R16  3k3  R-EU_R0805  [R0805]
R17  3k3  R-EU_R0805  [R0805]
R22  100k  R-EU_R0805  [R0805]
R23  1k  R-EU_R0805  [R0805]
R24  ?  R-EU_R0805  [R0805]
R25  ?  R-EU_R0805  [R0805]
R30  4k7  R-EU_R0603  [R0603]
R31  47  R-EU_R0603  [R0603]
R32  40 1%  R-EU_R0805  [R0805]
R33  40 1%  R-EU_R0805  [R0805]
R34  1k 0.1%  R-EU_R0805  [R0805]
R35  1k 0.1%  R-EU_R0805  [R0805]
R36  4k7  R-EU_R0603  [R0603]
R37  4k7  R-EU_R0603  [R0603]
R38  47  R-EU_R0603  [R0603]
R39  40 1%  R-EU_R0805  [R0805]
R40  40 1%  R-EU_R0805  [R0805]
R41  1k 0.1%  R-EU_R0805  [R0805]
R42  1k 0.1%  R-EU_R0805  [R0805]
R43  4k7  R-EU_R0603  [R0603]
R44  4k7  R-EU_R0603  [R0603]
R45  47  R-EU_R0603  [R0603]
R46  40 1%  R-EU_R0805  [R0805]
R47  40 1%  R-EU_R0805  [R0805]
R48  1k 0.1%  R-EU_R0805  [R0805]
R49  1k 0.1%  R-EU_R0805  [R0805]
R50  4k7  R-EU_R0603  [R0603]
R51  4k7  R-EU_R0603  [R0603]
R52  47  R-EU_R0603  [R0603]
R53  40 1%  R-EU_R0805  [R0805]
R54  40 1%  R-EU_R0805  [R0805]
R55  1k 0.1%  R-EU_R0805  [R0805]
R56  1k 0.1%  R-EU_R0805  [R0805]
R57  4k7  R-EU_R0603  [R0603]
R58  4k7  R-EU_R0603  [R0603]
R59  47  R-EU_R0603  [R0603]
R60  40 1%  R-EU_R0805  [R0805]
R61  40 1%  R-EU_R0805  [R0805]
R62  1k 0.1%  R-EU_R0805  [R0805]
R63  1k 0.1%  R-EU_R0805  [R0805]
R64  inf  R-EU_R0805  [R0805]
R65  inf  R-EU_R0805  [R0805]
R66  inf  R-TRIMM3224X  [RTRIM3224X]
R_I1_PT1  R-EU_R0603  [R0603]
R_I1_PT2  R-EU_R0603  [R0603]
R_I1_PT3  5k  R-EU_R0603  [R0603]
R_I2_PT1  R-EU_R0603  [R0603]
R_I2_PT2  R-EU_R0603  [R0603]
R_I2_PT3  5k  R-EU_R0603  [R0603]
R_R1_PT1  R-EU_R0603  [R0603]
R_R1_PT2  R-EU_R0603  [R0603]
R_R1_PT3  3k16  R-EU_R0603  [R0603]
R_R2_PT1  R-EU_R0603  [R0603]
R_R2_PT2  R-EU_R0603  [R0603]
R_R2_PT3  inf  R-EU_R0603  [R0603]
R_REF_PT1  R-EU_R0603  [R0603]
R_REF_PT2  R-EU_R0603  [R0603]
R_REF_PT3  1k62  R-EU_R0603  [R0603]
RN11  3k  4R-NEXBS8V  [EXBS8V]
RN12  1k  4R-NEXBS8V  [EXBS8V]
RN_A_PT1  47  4R-N0603-ARC  [0603-ARC]
RN_A_PT2  47  4R-N0603-ARC  [0603-ARC]
RN_A_PT3  47  4R-N0603-ARC  [0603-ARC]
RN_B_PT1  47  4R-N0603-ARC  [0603-ARC]
RN_B_PT2  47  4R-N0603-ARC  [0603-ARC]
RN_B_PT3  47  4R-N0603-ARC  [0603-ARC]
RN_DMS1  47  4R-N0603-ARC  [0603-ARC]
RN_DMS2  47  4R-N0603-ARC  [0603-ARC]
RN_DMS3  47  4R-N0603-ARC  [0603-ARC]
RN_DMS4  47  4R-N0603-ARC  [0603-ARC]
RN_DMS5  47  4R-N0603-ARC  [0603-ARC]
RN_DMS6  47  4R-N0603-ARC  [0603-ARC]
U$1  COMMON_MODE_CHOKE  [COMMON_MODE_CHOKE]
U$2  COMMON_MODE_CHOKE  [COMMON_MODE_CHOKE]
U$3  COMMON_MODE_CHOKE  [COMMON_MODE_CHOKE]
U$4  COMMON_MODE_CHOKE  [COMMON_MODE_CHOKE]
U$5  COMMON_MODE_CHOKE  [COMMON_MODE_CHOKE]
U$6  COMMON_MODE_CHOKE  [COMMON_MODE_CHOKE]
U_7805  LM78L05ACMX/NOPB  [SOIC8]
U_ADC_DMS1  ADS1147TSSOP20  [TSSOP20]
U_ADC_DMS2  ADS1147TSSOP20  [TSSOP20]
U_ADC_DMS3  ADS1147TSSOP20  [TSSOP20]
U_ADC_DMS4  ADS1147TSSOP20  [TSSOP20]
U_ADC_DMS5  ADS1147TSSOP20  [TSSOP20]
U_ADC_DMS6  ADS1147TSSOP20  [TSSOP20]
U_ADC_PT1  ADS1147TSSOP20  [TSSOP20]
U_ADC_PT2  ADS1147TSSOP20  [TSSOP20]
U_ADC_PT3  ADS1147TSSOP20  [TSSOP20]
U_ADR366_3  ADR366WAUJZ  ADR36_UJZ  [SOT23-5]
U_CH340G  CH340G  [SOIC16]
U_FLASH1  S70FL01GS  [SO16]
U_FLASH2  S70FL01GS  [SO16]
U_LT1528  LT1528  [Q5-DD]
U_MAX488  MAX488CSA  [SO08]
U_OPTO_1  MOCD207MSOIC-8  [SOIC127P594X363-8N]
U_OPTO_2  MOCD207MSOIC-8  [SOIC127P594X363-8N]
U_OPTO_3  MOCD207MSOIC-8  [SOIC127P594X363-8N]
U_TRACODCDC  THN10-2411WIR  THL_20WI_SERIES  [THL_20WI_SERIES]

### Nets
3V3: C3.1 C5.1 C9.1 C10.1 C15.1 C19.1 C24.1 C25.1 C28.1 C29.1 C30.1 C31.1 C32.1 C33.1 C37.2 C41.+ C47.1 C48.1 C54.1 C55.1 C67.+ C68.+ C69.+ C70.+ C71.+ C72.+ C73.+ C_AVDD_PT1.1 C_AVDD_PT2.1 C_AVDD_PT3.1 C_DVDD_PT1.1 C_DVDD_PT2.1 C_DVDD_PT3.1 R1.1 R2.2 R6.2 R8.1 R13.2 R30.2 R34.2 R36.1 R37.2 R41.2 R43.1 R44.2 R48.2 R50.1 R51.2 R55.2 R57.1 R58.2 R62.2 RN12.1 RN12.2 RN12.3 RN12.4 RN_A_PT1.8 RN_A_PT2.8 RN_A_PT3.8 RN_B_PT1.6 RN_B_PT2.6 RN_B_PT3.6 U$1.P$2 U$2.P$2 U$3.P$2 U$4.P$2 U$5.P$2 U$6.P$2 U_ADC_DMS1.1(DVDD) U_ADC_DMS1.14(AVDD) U_ADC_DMS2.1(DVDD) U_ADC_DMS2.14(AVDD) U_ADC_DMS3.1(DVDD) U_ADC_DMS3.14(AVDD) U_ADC_DMS4.1(DVDD) U_ADC_DMS4.14(AVDD) U_ADC_DMS5.1(DVDD) U_ADC_DMS5.14(AVDD) U_ADC_DMS6.1(DVDD) U_ADC_DMS6.14(AVDD) U_ADC_PT1.1(DVDD) U_ADC_PT1.14(AVDD) U_ADC_PT2.1(DVDD) U_ADC_PT2.14(AVDD) U_ADC_PT3.1(DVDD) U_ADC_PT3.14(AVDD) U_CH340G.4(V3) U_CH340G.16(VCC) U_FLASH1.2(VCC) U_FLASH2.2(VCC) U_LT1528.1(OUT) U_LT1528.2(SENSE) ; also sheet 1,2,4
3V3REF: C74.2 C75.2 R24.2 U_ADR366_3.4(VOUT) ; also sheet 1
5V: C35.2 C36.2 C39.+ C40.+ C52.2 C64.+ C65.+ C66.+ R65.1 R66.3(E) U_ADR366_3.3(VIN) U_LT1528.4(SHDN) U_LT1528.5(IN) U_TRACODCDC.3(+VOUT) ; also sheet 2,4
5V-28V: C43.1 R14.2 R16.1 U_7805.1(VOUT) U_MAX488.1(VCC) ; also sheet 4
28V: C34.2 C38.+ C42.2 C60.+ C61.+ C62.+ RN11.1 RN11.2 RN11.3 RN11.4 U_7805.8(VIN) U_TRACODCDC.1(+VIN) ; also sheet 2,4
28VGND: C34.1 C38.- C42.1 C43.2 C44.2 C60.- C61.- C62.- D5.A D6.A R11.1 R17.1 U_7805.2(GND) U_7805.3(GND) U_7805.6(GND) U_7805.7(GND) U_MAX488.4(GND) U_OPTO_3.5(EMT2) U_TRACODCDC.2(-VIN) ; also sheet 2,4
!CS!_DMS1: R3.2 ; also sheet 1
!CS!_DMS2: R31.2 ; also sheet 1
!CS!_DMS3: R38.2 ; also sheet 1
!CS!_DMS4: R45.2 ; also sheet 1
!CS!_DMS5: R52.2 ; also sheet 1
!CS!_DMS6: R59.2 ; also sheet 1
!CS!_PT1: RN_B_PT1.7 ; also sheet 1
!CS!_PT2: RN_B_PT2.7 ; also sheet 1
!CS!_PT3: RN_B_PT3.7 ; also sheet 1
!DRDY!_DMS1: RN_DMS1.5 ; also sheet 1
!DRDY!_DMS2: RN_DMS2.5 ; also sheet 1
!DRDY!_DMS3: RN_DMS3.5 ; also sheet 1
!DRDY!_DMS4: RN_DMS4.5 ; also sheet 1
!DRDY!_DMS5: RN_DMS5.5 ; also sheet 1
!DRDY!_DMS6: RN_DMS6.5 ; also sheet 1
!DRDY!_PT1: RN_B_PT1.8 ; also sheet 1
!DRDY!_PT2: RN_B_PT2.8 ; also sheet 1
!DRDY!_PT3: RN_B_PT3.8 ; also sheet 1
DAPI_N: D1.C U_CH340G.6(D-) ; also sheet 2
DAPI_P: D2.C U_CH340G.5(D+) ; also sheet 2
DAPI_RX: D4.C U_CH340G.2(TX) ; also sheet 1
DAPI_TX: D3.C U_CH340G.3(RX) ; also sheet 1
DMS11: U$2.P$1 ; also sheet 2
DMS12: U$2.P$3 ; also sheet 2
DMS13: U$2.P$5 ; also sheet 2
DMS21: U$1.P$1 ; also sheet 2
DMS22: U$1.P$3 ; also sheet 2
DMS23: U$1.P$5 ; also sheet 2
DMS31: U$3.P$1 ; also sheet 2
DMS32: U$3.P$3 ; also sheet 2
DMS33: U$3.P$5 ; also sheet 2
DMS41: U$4.P$1 ; also sheet 2
DMS42: U$4.P$3 ; also sheet 2
DMS43: U$4.P$5 ; also sheet 2
DMS51: U$5.P$1 ; also sheet 2
DMS52: U$5.P$3 ; also sheet 2
DMS53: U$5.P$5 ; also sheet 2
DMS61: U$6.P$1 ; also sheet 2
DMS62: U$6.P$3 ; also sheet 2
DMS63: U$6.P$5 ; also sheet 2
EXP_IN: D5.C U_MAX488.2(RO) U_OPTO_3.1(A1)
EXP_IN_N: R15.1 R17.2 U_MAX488.7(B) ; also sheet 2
EXP_IN_OPT: D10.C R13.1 U_OPTO_3.8(COL1) ; also sheet 1
EXP_IN_P: R10.2 R16.2 U_MAX488.8(A) ; also sheet 2
EXP_OUT: D6.C R14.1 U_MAX488.3(DI) U_OPTO_3.6(COL2)
EXP_OUT_N: U_MAX488.6(Z) ; also sheet 2
EXP_OUT_OPT: U_OPTO_3.3(A2) ; also sheet 1
EXP_OUT_P: U_MAX488.5(Y) ; also sheet 2
FL_1_CS1: U_FLASH1.7(CS1) ; also sheet 1
FL_1_CS2: U_FLASH1.6(CS2) ; also sheet 1
FL_1_HLD: U_FLASH1.1(HOLD) ; also sheet 1
FL_1_RES: U_FLASH1.3(RESET) ; also sheet 1
FL_1_WP: U_FLASH1.9(WP) ; also sheet 1
FL_2_CS1: U_FLASH2.7(CS1) ; also sheet 1
FL_2_CS2: U_FLASH2.6(CS2) ; also sheet 1
FL_2_HLD: U_FLASH2.1(HOLD) ; also sheet 1
FL_2_RES: U_FLASH2.3(RESET) ; also sheet 1
FL_2_WP: U_FLASH2.9(WP) ; also sheet 1
GND: C1.2 C2.2 C3.2 C4.2 C5.2 C6.1 C8.2 C9.2 C10.2 C11.2 C12.1 C14.2 C15.2 C19.2 C20.2 C21.1 C23.2 C24.2 C25.2 C26.2 C27.1 C28.2 C29.2 C30.2 C31.2 C32.2 C33.2 C35.1 C36.1 C37.1 C39.- C40.- C41.- C46.2 C47.2 C48.2 C49.2 C50.1 C52.1 C53.2 C54.2 C55.2 C56.2 C57.1 C59.2 C64.- C65.- C66.- C67.- C68.- C69.- C70.- C71.- C72.- C73.- C74.1 C75.1 C_AVDD_PT1.2 C_AVDD_PT2.2 C_AVDD_PT3.2 C_DVDD_PT1.2 C_DVDD_PT2.2 C_DVDD_PT3.2 C_ICM1_PT1.1 C_ICM1_PT2.1 C_ICM1_PT3.1 C_ICM2_PT1.2 C_ICM2_PT2.2 C_ICM2_PT3.2 C_RCM1_PT1.1 C_RCM1_PT2.1 C_RCM1_PT3.1 C_RCM2_PT1.2 C_RCM2_PT2.2 C_RCM2_PT3.2 C_VREF_PT1.2 C_VREF_PT2.2 C_VREF_PT3.2 D1.A D2.A D3.A D4.A D7.A D8.A D9.A D10.A D11.A D12.A R7.2 R12.1 R23.1 R35.2 R42.2 R49.2 R56.2 R63.2 R64.1 R66.1(A) R_R2_PT1.2 R_R2_PT2.2 R_R2_PT3.2 R_REF_PT1.1 R_REF_PT2.1 R_REF_PT3.1 RN_B_PT1.4 RN_B_PT1.5 RN_B_PT2.4 RN_B_PT2.5 RN_B_PT3.4 RN_B_PT3.5 U$1.P$6 U$2.P$6 U$3.P$6 U$4.P$6 U$5.P$6 U$6.P$6 U_ADC_DMS1.2(DGND/DSS) U_ADC_DMS1.3(CLK) U_ADC_DMS1.8(VREFCOM) U_ADC_DMS1.13(AVSS) U_ADC_DMS2.2(DGND/DSS) U_ADC_DMS2.3(CLK) U_ADC_DMS2.8(VREFCOM) U_ADC_DMS2.13(AVSS) U_ADC_DMS3.2(DGND/DSS) U_ADC_DMS3.3(CLK) U_ADC_DMS3.8(VREFCOM) U_ADC_DMS3.13(AVSS) U_ADC_DMS4.2(DGND/DSS) U_ADC_DMS4.3(CLK) U_ADC_DMS4.8(VREFCOM) U_ADC_DMS4.13(AVSS) U_ADC_DMS5.2(DGND/DSS) U_ADC_DMS5.3(CLK) U_ADC_DMS5.8(VREFCOM) U_ADC_DMS5.13(AVSS) U_ADC_DMS6.2(DGND/DSS) U_ADC_DMS6.3(CLK) U_ADC_DMS6.8(VREFCOM) U_ADC_DMS6.13(AVSS) U_ADC_PT1.2(DGND/DSS) U_ADC_PT1.3(CLK) U_ADC_PT1.8(VREFCOM) U_ADC_PT1.13(AVSS) U_ADC_PT2.2(DGND/DSS) U_ADC_PT2.3(CLK) U_ADC_PT2.8(VREFCOM) U_ADC_PT2.13(AVSS) U_ADC_PT3.2(DGND/DSS) U_ADC_PT3.3(CLK) U_ADC_PT3.8(VREFCOM) U_ADC_PT3.13(AVSS) U_ADR366_3.2(GND) U_CH340G.1(GND) U_FLASH1.10(VSS) U_FLASH2.10(VSS) U_LT1528.3(GND) U_LT1528.6(GND) U_OPTO_1.5(EMT2) U_OPTO_1.7(EMT1) U_OPTO_2.5(EMT2) U_OPTO_2.7(EMT1) U_OPTO_3.7(EMT1) U_TRACODCDC.5(-VOUT) ; supply symbol labelled SUPPLY0_GND_ ; also sheet 1,2,4
INTERSPU_RX: D11.C ; also sheet 1,2
INTERSPU_TX: D12.C ; also sheet 1,2
LO: U_OPTO_2.2(C1) ; also sheet 2
LO_OPT: D7.C RN12.6 U_OPTO_2.8(COL1) ; also sheet 1
N$1: C2.1 Q1.2 U_CH340G.8(XO)
N$2: R2.1 U_ADC_DMS1.15(START)
N$3: C1.1 Q1.1 U_CH340G.7(XI)
N$4: C_RCM2_PT2.1 C_RDIFF_PT2.2 R_R2_PT2.1 U_ADC_PT2.6(REFN0/GPIO1)
N$5: C_RCM1_PT2.2 C_RDIFF_PT2.1 R_R1_PT2.1 U_ADC_PT2.5(REFP0/GPIO0)
N$6: C_ICM2_PT2.1 C_IDIFF_PT2.2 R_I2_PT2.1 U_ADC_PT2.11(AIN2/IEXC/GPIO2)
N$7: C12.2 C13.1 R32.1 U_ADC_DMS2.9(AIN0/IEXC)
N$8: C_VREF_PT1.1 U_ADC_PT1.7(VREFOUT)
N$9: C_ICM2_PT1.1 C_IDIFF_PT1.2 R_I2_PT1.1 U_ADC_PT1.11(AIN2/IEXC/GPIO2)
N$10: RN_DMS1.1 U_ADC_DMS1.20(SCLK)
N$11: C13.2 C14.1 R33.1 U_ADC_DMS2.10(AIN1/IEXC)
N$12: R33.2 R34.1 R35.1
N$13: C_RCM2_PT1.1 C_RDIFF_PT1.2 R_R2_PT1.1 U_ADC_PT1.6(REFN0/GPIO1)
N$14: C_RCM1_PT1.2 C_RDIFF_PT1.1 R_R1_PT1.1 U_ADC_PT1.5(REFP0/GPIO0)
N$15: C_ICM1_PT1.2 C_IDIFF_PT1.1 R_I1_PT1.1 U_ADC_PT1.10(AIN1/IEXC)
N$16: RN_A_PT1.2 U_ADC_PT1.20(SCLK)
N$17: R64.2 R65.2 R66.2(S) U_TRACODCDC.4(TRIM)
N$20: RN_A_PT1.3 U_ADC_PT1.19(DIN)
N$21: RN_A_PT1.4 U_ADC_PT1.18(DOUT/!DRDY)
N$22: C_ICM1_PT2.2 C_IDIFF_PT2.1 R_I1_PT2.1 U_ADC_PT2.10(AIN1/IEXC)
N$23: C_VREF_PT2.1 U_ADC_PT2.7(VREFOUT)
N$24: RN_A_PT2.2 U_ADC_PT2.20(SCLK)
N$25: RN_B_PT1.1 U_ADC_PT1.17(!DRDY)
N$26: RN_B_PT1.2 U_ADC_PT1.16(!CS)
N$27: RN_B_PT1.3 U_ADC_PT1.15(START)
N$28: RN_A_PT2.3 U_ADC_PT2.19(DIN)
N$29: RN_A_PT2.4 U_ADC_PT2.18(DOUT/!DRDY)
N$37: RN_B_PT2.1 U_ADC_PT2.17(!DRDY)
N$38: RN_B_PT2.2 U_ADC_PT2.16(!CS)
N$39: RN_B_PT2.3 U_ADC_PT2.15(START)
N$40: C_RCM2_PT3.1 C_RDIFF_PT3.2 R_R2_PT3.1 U_ADC_PT3.6(REFN0/GPIO1)
N$41: C_RCM1_PT3.2 C_RDIFF_PT3.1 R_R1_PT3.1 U_ADC_PT3.5(REFP0/GPIO0)
N$42: RN11.6 U_OPTO_1.1(A1)
N$43: RN11.5 U_OPTO_1.3(A2)
N$44: R12.2 U_OPTO_3.4(C2)
N$45: RN12.5 U_OPTO_2.6(COL2)
N$46: RN11.8 U_OPTO_2.1(A1)
N$47: RN11.7 U_OPTO_2.3(A2)
N$48: U_OPTO_2.4(C2)
N$49: R11.2 U_OPTO_3.2(C1)
N$50: C44.1 R10.1 R15.2
N$53: C_ICM2_PT3.1 C_IDIFF_PT3.2 R_I2_PT3.1 U_ADC_PT3.11(AIN2/IEXC/GPIO2)
N$54: C_ICM1_PT3.2 C_IDIFF_PT3.1 R_I1_PT3.1 U_ADC_PT3.10(AIN1/IEXC)
N$57: C_VREF_PT3.1 U_ADC_PT3.7(VREFOUT)
N$58: RN_A_PT3.2 U_ADC_PT3.20(SCLK)
N$59: RN_A_PT3.3 U_ADC_PT3.19(DIN)
N$60: RN_A_PT3.4 U_ADC_PT3.18(DOUT/!DRDY)
N$61: RN_B_PT3.1 U_ADC_PT3.17(!DRDY)
N$62: RN_B_PT3.2 U_ADC_PT3.16(!CS)
N$63: RN_B_PT3.3 U_ADC_PT3.15(START)
N$64: RN_A_PT3.1 U_ADC_PT3.4(!RESET)
N$65: RN_A_PT2.1 U_ADC_PT2.4(!RESET)
N$66: RN_A_PT1.1 U_ADC_PT1.4(!RESET)
N$67: C11.1 U_ADC_DMS2.7(VREFOUT)
N$68: R22.1 U_ADR366_3.5(TRIM)
N$69: R22.2 R24.1 R25.2
N$70: R23.2 R25.1
N$72: R32.2 U$1.P$4
N$73: R1.2 U_ADC_DMS1.4(!RESET)
N$74: RN_DMS1.2 U_ADC_DMS1.19(DIN)
N$75: RN_DMS1.3 U_ADC_DMS1.18(DOUT/!DRDY)
N$76: RN_DMS1.4 U_ADC_DMS1.17(!DRDY)
N$77: R3.1 U_ADC_DMS1.16(!CS)
N$78: R8.2 U_ADC_DMS2.4(!RESET)
N$79: R30.1 U_ADC_DMS2.15(START)
N$80: C6.2 C7.1 R4.1 U_ADC_DMS1.9(AIN0/IEXC)
N$81: C7.2 C8.1 R5.1 U_ADC_DMS1.10(AIN1/IEXC)
N$82: R5.2 R6.1 R7.1
N$83: C4.1 U_ADC_DMS1.7(VREFOUT)
N$84: R4.2 U$2.P$4
N$85: RN_DMS2.1 U_ADC_DMS2.20(SCLK)
N$86: RN_DMS2.2 U_ADC_DMS2.19(DIN)
N$87: RN_DMS2.3 U_ADC_DMS2.18(DOUT/!DRDY)
N$88: RN_DMS2.4 U_ADC_DMS2.17(!DRDY)
N$89: R31.1 U_ADC_DMS2.16(!CS)
N$90: C21.2 C22.1 R39.1 U_ADC_DMS3.9(AIN0/IEXC)
N$91: C22.2 C23.1 R40.1 U_ADC_DMS3.10(AIN1/IEXC)
N$92: R40.2 R41.1 R42.1
N$93: C20.1 U_ADC_DMS3.7(VREFOUT)
N$94: R39.2 U$3.P$4
N$95: R36.2 U_ADC_DMS3.4(!RESET)
N$96: R37.1 U_ADC_DMS3.15(START)
N$97: RN_DMS3.1 U_ADC_DMS3.20(SCLK)
N$98: RN_DMS3.2 U_ADC_DMS3.19(DIN)
N$99: RN_DMS3.3 U_ADC_DMS3.18(DOUT/!DRDY)
N$100: RN_DMS3.4 U_ADC_DMS3.17(!DRDY)
N$101: R38.1 U_ADC_DMS3.16(!CS)
N$102: C27.2 C45.1 R46.1 U_ADC_DMS4.9(AIN0/IEXC)
N$103: C45.2 C46.1 R47.1 U_ADC_DMS4.10(AIN1/IEXC)
N$104: R47.2 R48.1 R49.1
N$105: C26.1 U_ADC_DMS4.7(VREFOUT)
N$106: R46.2 U$4.P$4
N$107: R43.2 U_ADC_DMS4.4(!RESET)
N$108: R44.1 U_ADC_DMS4.15(START)
N$109: RN_DMS4.1 U_ADC_DMS4.20(SCLK)
N$110: RN_DMS4.2 U_ADC_DMS4.19(DIN)
N$111: RN_DMS4.3 U_ADC_DMS4.18(DOUT/!DRDY)
N$112: RN_DMS4.4 U_ADC_DMS4.17(!DRDY)
N$113: R45.1 U_ADC_DMS4.16(!CS)
N$114: C50.2 C51.1 R53.1 U_ADC_DMS5.9(AIN0/IEXC)
N$115: C51.2 C53.1 R54.1 U_ADC_DMS5.10(AIN1/IEXC)
N$116: R54.2 R55.1 R56.1
N$117: C49.1 U_ADC_DMS5.7(VREFOUT)
N$118: R53.2 U$5.P$4
N$119: R50.2 U_ADC_DMS5.4(!RESET)
N$120: R51.1 U_ADC_DMS5.15(START)
N$121: RN_DMS5.1 U_ADC_DMS5.20(SCLK)
N$122: RN_DMS5.2 U_ADC_DMS5.19(DIN)
N$123: RN_DMS5.3 U_ADC_DMS5.18(DOUT/!DRDY)
N$124: RN_DMS5.4 U_ADC_DMS5.17(!DRDY)
N$125: R52.1 U_ADC_DMS5.16(!CS)
N$128: C57.2 C58.1 R60.1 U_ADC_DMS6.9(AIN0/IEXC)
N$129: C58.2 C59.1 R61.1 U_ADC_DMS6.10(AIN1/IEXC)
N$130: R61.2 R62.1 R63.1
N$131: C56.1 U_ADC_DMS6.7(VREFOUT)
N$132: R60.2 U$6.P$4
N$133: R57.2 U_ADC_DMS6.4(!RESET)
N$134: R58.1 U_ADC_DMS6.15(START)
N$135: RN_DMS6.1 U_ADC_DMS6.20(SCLK)
N$136: RN_DMS6.2 U_ADC_DMS6.19(DIN)
N$137: RN_DMS6.3 U_ADC_DMS6.18(DOUT/!DRDY)
N$138: RN_DMS6.4 U_ADC_DMS6.17(!DRDY)
N$139: R59.1 U_ADC_DMS6.16(!CS)
PT11: R_I1_PT1.2 U_ADC_PT1.9(AIN0/IEXC) ; also sheet 2
PT12: R_I2_PT1.2 U_ADC_PT1.12(AIN3/IEXC/GPIO3) ; also sheet 2
PT13: R_R1_PT1.2 R_REF_PT1.2 ; also sheet 2
PT21: R_I1_PT2.2 U_ADC_PT2.9(AIN0/IEXC) ; also sheet 2
PT22: R_I2_PT2.2 U_ADC_PT2.12(AIN3/IEXC/GPIO3) ; also sheet 2
PT23: R_R1_PT2.2 R_REF_PT2.2 ; also sheet 2
PT31: R_I1_PT3.2 U_ADC_PT3.9(AIN0/IEXC) ; also sheet 2
PT32: R_I2_PT3.2 U_ADC_PT3.12(AIN3/IEXC/GPIO3) ; also sheet 2
PT33: R_R1_PT3.2 R_REF_PT3.2 ; also sheet 2
SODS: U_OPTO_1.2(C1) ; also sheet 2
SODS_OPT: D8.C RN12.8 U_OPTO_1.8(COL1) ; also sheet 1
SOE: U_OPTO_1.4(C2) ; also sheet 2
SOE_OPT: D9.C RN12.7 U_OPTO_1.6(COL2) ; also sheet 1
SPI2_MISO: U_FLASH2.8(SO) ; also sheet 1
SPI2_MOSI: U_FLASH2.15(SI) ; also sheet 1
SPI2_SCK: U_FLASH2.16(SCK) ; also sheet 1
SPI3_MISO: RN_A_PT1.5 RN_A_PT2.5 RN_A_PT3.5 ; also sheet 1
SPI3_MOSI: RN_A_PT1.6 RN_A_PT2.6 RN_A_PT3.6 ; also sheet 1
SPI3_SCK: RN_A_PT1.7 RN_A_PT2.7 RN_A_PT3.7 ; also sheet 1
SPI4_MISO: RN_DMS1.6 RN_DMS2.6 RN_DMS3.6 RN_DMS4.6 RN_DMS5.6 RN_DMS6.6 ; also sheet 1
SPI4_MOSI: RN_DMS1.7 RN_DMS2.7 RN_DMS3.7 RN_DMS4.7 RN_DMS5.7 RN_DMS6.7 ; also sheet 1
SPI4_SCK: RN_DMS1.8 RN_DMS2.8 RN_DMS3.8 RN_DMS4.8 RN_DMS5.8 RN_DMS6.8 ; also sheet 1
SPI6_MISO: U_FLASH1.8(SO) ; also sheet 1
SPI6_MOSI: U_FLASH1.15(SI) ; also sheet 1
SPI6_SCK: U_FLASH1.16(SCK) ; also sheet 1
Unconnected: U_ADC_DMS1.5(REFP0/GPIO0) U_ADC_DMS1.6(REFN0/GPIO1) U_ADC_DMS1.11(AIN2/IEXC/GPIO2) U_ADC_DMS1.12(AIN3/IEXC/GPIO3) U_ADC_DMS2.5(REFP0/GPIO0) U_ADC_DMS2.6(REFN0/GPIO1) U_ADC_DMS2.11(AIN2/IEXC/GPIO2) U_ADC_DMS2.12(AIN3/IEXC/GPIO3) U_ADC_DMS3.5(REFP0/GPIO0) U_ADC_DMS3.6(REFN0/GPIO1) U_ADC_DMS3.11(AIN2/IEXC/GPIO2) U_ADC_DMS3.12(AIN3/IEXC/GPIO3) U_ADC_DMS4.5(REFP0/GPIO0) U_ADC_DMS4.6(REFN0/GPIO1) U_ADC_DMS4.11(AIN2/IEXC/GPIO2) U_ADC_DMS4.12(AIN3/IEXC/GPIO3) U_ADC_DMS5.5(REFP0/GPIO0) U_ADC_DMS5.6(REFN0/GPIO1) U_ADC_DMS5.11(AIN2/IEXC/GPIO2) U_ADC_DMS5.12(AIN3/IEXC/GPIO3) U_ADC_DMS6.5(REFP0/GPIO0) U_ADC_DMS6.6(REFN0/GPIO1) U_ADC_DMS6.11(AIN2/IEXC/GPIO2) U_ADC_DMS6.12(AIN3/IEXC/GPIO3) U_CH340G.9(CTS) U_CH340G.10(DSR) U_CH340G.11(RI) U_CH340G.12(DCD) U_CH340G.13(DTR) U_CH340G.14(RTS) U_CH340G.15(RS232) U_TRACODCDC.6(RMT_ON_OFF)

### Notes on the sheet
- Ref voltage | Opto. isolation | logic side    <->  RXSM side | functionality confirmed
- Spike/ESD protection | Filter/Buffer caps.
- no testing needed
- Feinabgleich
- TODO:
  input fuse?
- V. Reg
- Trim:
    up:
      R=(12775/U_out) - 2050
    down:
      R=((U_out * 5110) / (5 - U_out)) - 2050
- RS422 driver
- LM78L05ACMX/NOPB
- FLASH  mem
- USB-
    UART
- FL1 | FL2
- ADCs | all logic sided on this page
- 3dB attenuation @ 1989Hz
- WE-SL3 SMT COMMON
  MODE LINE FILT
- 3dB attenuation @ 1989Hz
- WE-SL3 SMT COMMON
  MODE LINE FILT
- 3dB attenuation @ 1989Hz
- WE-SL3 SMT COMMON
  MODE LINE FILT
- 3dB attenuation @ 1989Hz
- WE-SL3 SMT COMMON
  MODE LINE FILT
- 3dB attenuation @ 1989Hz
- WE-SL3 SMT COMMON
  MODE LINE FILT
- 3dB attenuation @ 1989Hz
- WE-SL3 SMT COMMON
  MODE LINE FILT

## Sheet 4 of 4: IO/LED
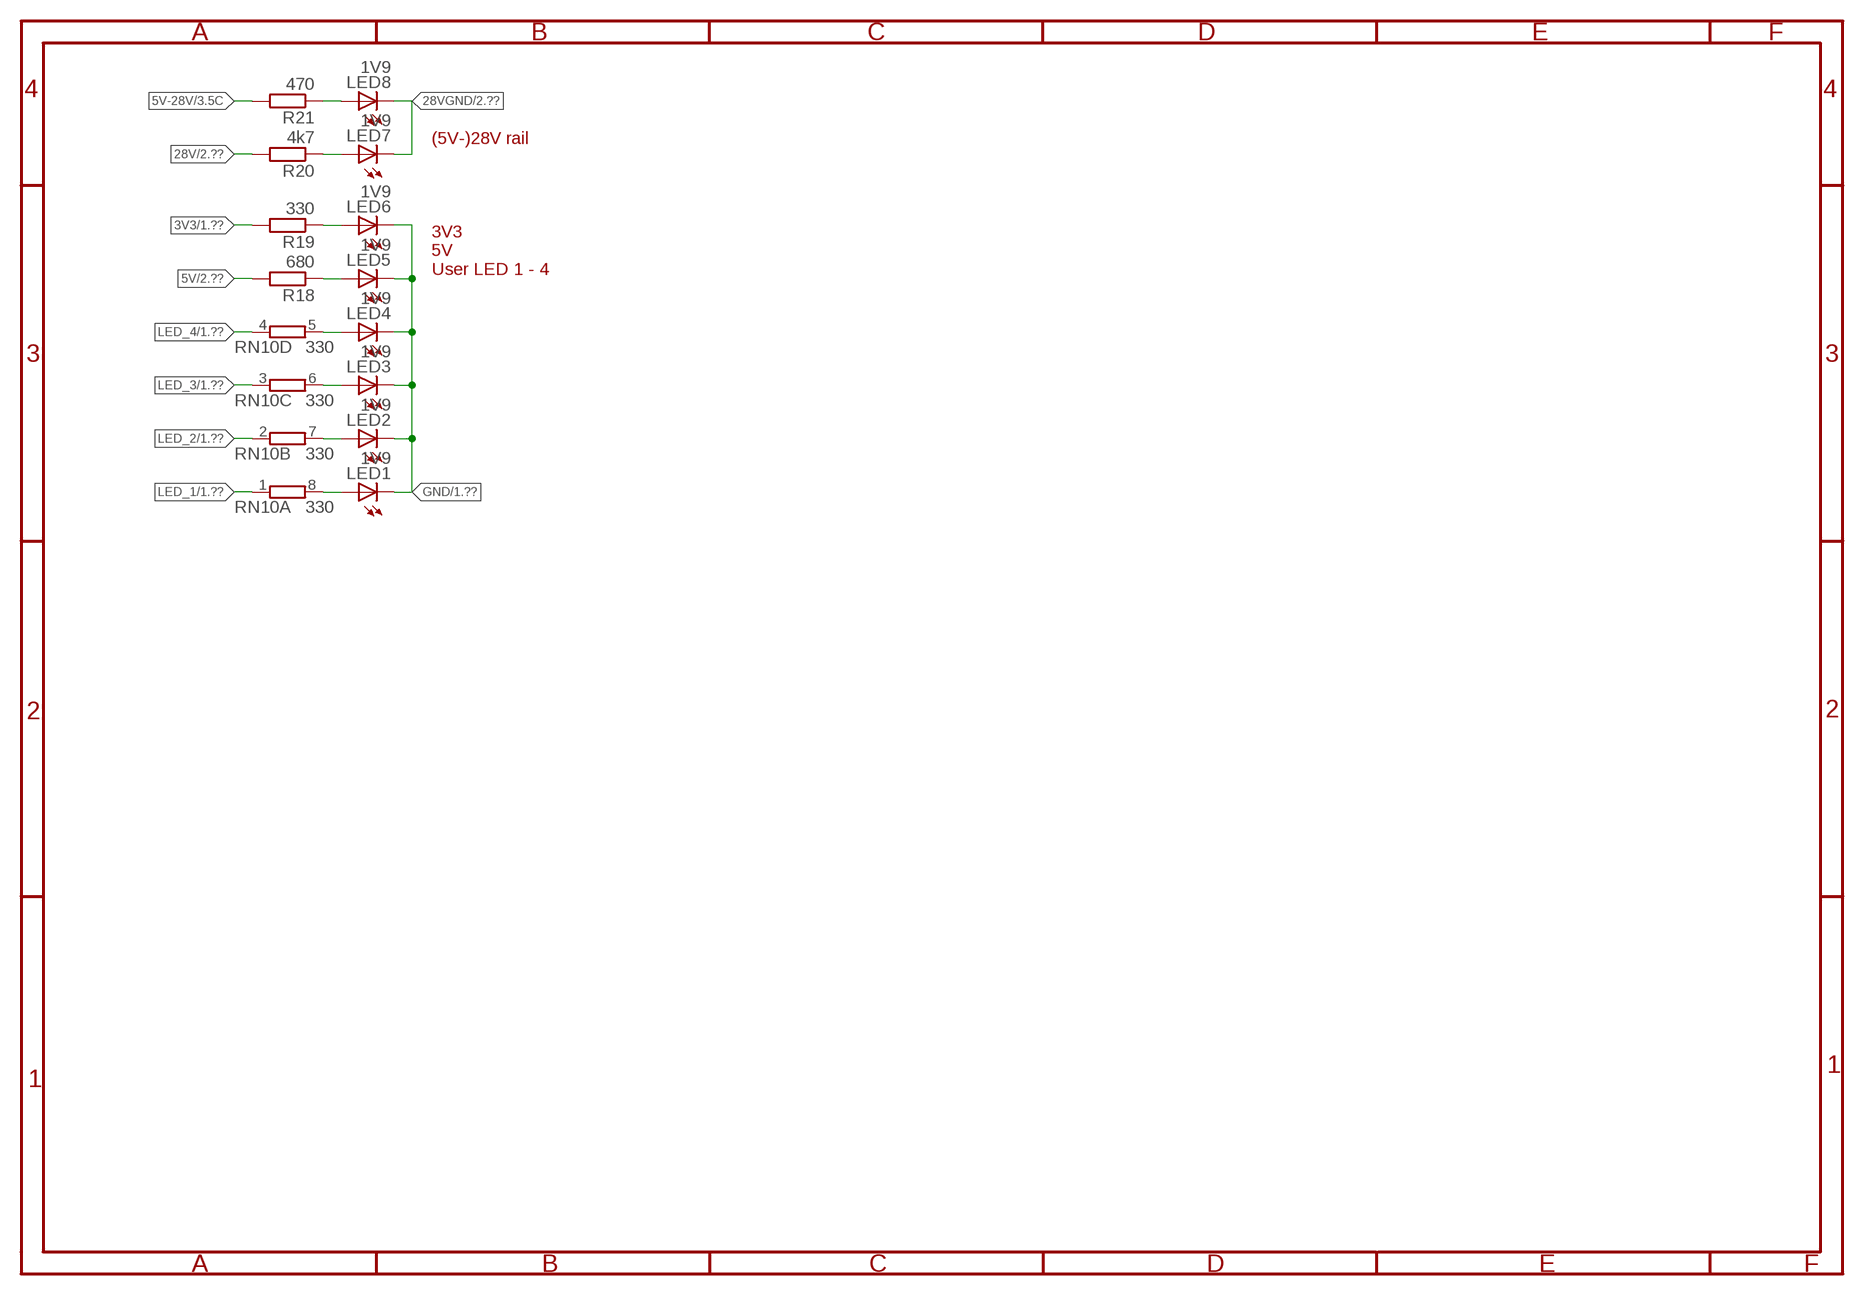
[diagram p7: schematic, sheet 4]

### Parts
LED1  1V9  LEDCHIP-LED0805  [CHIP-LED0805]
LED2  1V9  LEDCHIP-LED0805  [CHIP-LED0805]
LED3  1V9  LEDCHIP-LED0805  [CHIP-LED0805]
LED4  1V9  LEDCHIP-LED0805  [CHIP-LED0805]
LED5  1V9  LEDCHIP-LED0805  [CHIP-LED0805]
LED6  1V9  LEDCHIP-LED0805  [CHIP-LED0805]
LED7  1V9  LEDCHIP-LED0805  [CHIP-LED0805]
LED8  1V9  LEDCHIP-LED0805  [CHIP-LED0805]
R18  680  R-EU_R0805  [R0805]
R19  330  R-EU_R0805  [R0805]
R20  4k7  R-EU_R0805  [R0805]
R21  470  R-EU_R0805  [R0805]
RN10  330  4R-NEXBS8V  [EXBS8V]

### Nets
3V3: R19.2 ; also sheet 1,2,3
5V: R18.2 ; also sheet 2,3
5V-28V: R21.2 ; also sheet 3
28V: R20.2 ; also sheet 2,3
28VGND: LED7.C LED8.C ; also sheet 2,3
GND: LED1.C LED2.C LED3.C LED4.C LED5.C LED6.C ; also sheet 1,2,3
LED_1: RN10.1 ; also sheet 1
LED_2: RN10.2 ; also sheet 1
LED_3: RN10.3 ; also sheet 1
LED_4: RN10.4 ; also sheet 1
N$30: LED1.A RN10.8
N$31: LED2.A RN10.7
N$32: LED3.A RN10.6
N$33: LED4.A RN10.5
N$51: LED5.A R18.1
N$52: LED6.A R19.1
N$55: LED7.A R20.1
N$56: LED8.A R21.1

### Notes on the sheet
- (5V-)28V rail
  
  
  
  
  3V3
  5V
  User LED 1 - 4

## Library data of the parts
C1 C2 = rcl:C-EU: CAPACITOR, European symbol
C3-C17 C19-C37 C42-C59 C74 C75 C77 C78 C_AVDD_PT1-C_AVDD_PT3 C_DVDD_PT1-C_DVDD_PT3 C_ICM1_PT1-C_ICM1_PT3 C_ICM2_PT1-C_ICM2_PT3 C_IDIFF_PT1-C_IDIFF_PT3 C_RCM1_PT1-C_RCM1_PT3 C_RCM2_PT1-C_RCM2_PT3 C_RDIFF_PT1-C_RDIFF_PT3 C_VREF_PT1-C_VREF_PT3 = rcl:C-EU: CAPACITOR, European symbol; SPICEPREFIX: C
C18 C76 = aSparkFun:CAP: Capacitor Standard 0603 ceramic capacitor, and 0.1" leaded capacitor.
C38-C41 C60-C62 C64-C73 = rcl:CPOL-EU: POLARIZED CAPACITOR, European symbol; SPICEPREFIX: C
D1-D12 = diodes:DZ: Zener diode
JP1 = SparkFun-Jumpers:JUMPER-SMT_2_NC_PASTE: Normally closed solder jumper This jumper has an aperture in the stencil to allow solder paste to bridge the split in the wire so it's normally closed (NC). Wick off the solder to open the connection. Reapply solder to reclose the connection.
JP_MS = aSparkFun:M02: Header 2 Standard 2-pin 0.1" header. Use with straight break away headers (SKU : PRT-00116), right angle break away headers (PRT-00553), swiss pins (PRT-00743), machine pins (PRT-00117), and female headers (PRT-00115). Molex polarized connector foot print use with SKU : PRT-08233 with associated crimp pins and housings.
LED1-LED8 = adafruit:LED: LED OSRAM: - CHIPLED LG R971, LG N971, LY N971, LG Q971, LY Q971, LO R971, LY R971 LH N974, LH R974 LS Q976, LO Q976, LY Q976 LO Q996 - Hyper CHIPLED LW Q18S LB Q993, LB Q99A, LB R99A - SideLED LS A670, LO A670, LY A670, LG A670, LP A670 LB A673, LV A673, LT A673, LW A673 LH A674 LY A675 LS A676, LA A676, LO A676, LY A676, LW A676 LS A679, LY A679, LG A679 - Hyper Micro SIDELED® LS Y876, LA Y876, LO Y876, LY Y876 LT Y87S - SmartLED LW L88C, LW L88S LB L89C, LB L89S, LG L890 LS L89K, LO L89K, LY L89K LS L896, LA L896, LO L896, LY L896 - TOPLED LS T670, LO T670, LY T670, LG T670, LP T670 LSG T670, LSP T670, LSY T670, LOP T670, LYG T670 LG T671, LOG T671, LSG T671 LB T673, LV T673, LT T673, LW T673 LH T674 LS T676, LA T676, LO T676, LY T676, LB T676, LH T676, LSB T676, LW T676 LB T67C, LV T67C, LT T67C, LS T67K, LO T67K, LY T67K, LW E67C LS E67B, LA E67B, LO E67B, LY E67B, LB E67C, LV E67C, LT E67C LW T67C LS T679, LY T679, LG T679 LS T770, LO T770, LY T770, LG T770, LP T770 LB T773, LV T773, LT T773, LW T773 LH T774 LS E675, LA E675, LY E675, LS T675 LS T776, LA T776, LO T776, LY T776, LB T776 LHGB T686 LT T68C, LB T68C - Hyper Mini TOPLED® LB M676 - Mini TOPLED Santana® LG M470 LS M47K, LO M47K, LY M47K Source: http://www.osram.convergy.de/
Q1 = adafruit:CRYSTAL: CRYSTAL; OC_FARNELL: unknown; OC_NEWARK: unknown
R1-R8 R30-R63 R_I1_PT1-R_I1_PT3 R_I2_PT1-R_I2_PT3 R_R1_PT1-R_R1_PT3 R_R2_PT1-R_R2_PT3 R_REF_PT1-R_REF_PT3 = ++Bedrahtet:R-EU_: RESISTOR, European symbol
R9 R11-R14 R18-R29 R64 R65 = rcl:R-EU_: RESISTOR, European symbol; SPICEPREFIX: R
R10 R15-R17 = rcl:R-EU_: RESISTOR, European symbol
R66 = rcl:R-TRIMM: Trimm resistor; SPICEMODEL: X; SPICEPREFIXL: POT
RN10-RN12 RN_A_PT1-RN_A_PT3 RN_B_PT1-RN_B_PT3 RN_DMS1-RN_DMS6 = resistor-dil:4R-N: Array Chip Resistor Source: RS Component / Phycomp; OC_FARNELL: unknown; OC_NEWARK: unknown
SJ_MS = aSparkFun:SOLDERJUMPER: Solder Jumper Standard SMD solder jumper. Used to automate production. Two varients : Normally Open and Normally Closed are the same, but have different paste layers. NC will have a large amount of paste and should jumper during reflow.
U$1-U$6 = selfmade:COMMON_MODE_CHOKE: WE-SL3 SMT COMMON MODE LINE FILT
U$7 = adafruit:MICROSD: Micro-SD / Transflash card holder with SPI pinout For the 3M # 2908-05WB-MG and/or 4UCON #19656 push-push type
U$8 = everlight-fiber-optics-spdif:PLT131
U$9 = everlight-fiber-optics-spdif:PLR135: PLR153-T6 optic receiver 650nm
U_7805 = m-pad-2.1:LM78L05ACMX/NOPB
U_ADC_DMS1-U_ADC_DMS6 U_ADC_PT1-U_ADC_PT3 = ads11xx:ADS1147
U_ADR366_3 = ADR360:ADR36*: ADR360 (ADR360 ADR361 ADR363 ADR364 ADR365 ADR366 A|B UJZ) 5-Lead TSOT Low Power, Low Noise, Band Gap Voltage References Analog Devices Source: www.analog.com Technologies / Packages ADR36n A|B UJZ n Output-Voltage: 0 = 2.048V | 1 = 2.500 V | 3 = 3.000 V | 4 = 4.096 V | 5 = 5.000 V | 6 = 3.300 V A|B Grade: A = 25 ppm/K; +-6 mV max. | B = 9 ppm/K; +- 3mV max. UJZ Package: 5-Lead TSOT, RoHS-compliant Vin = 15 (18) V, Vdrop = 300 mV, Iout = +5 mA / -1mA Author: Dipl.-Ing. FH Rainer Bayer HHN Hochschule Heilbronn, rainer.bayer@hs-heilbronn.de Ingenieurbüro ing-rb, mail@ing-rb.de
U_CH340G = ch340g:CH340G
U_FLASH1 U_FLASH2 = S70FL01GS:S70FL01GS
U_LT1528 = aSparkFun:LT1528: LT1528 High current voltage regulator commonly used with GM862 cellular module. Spark Fun Electronics SKU : COM-00311. Footprint may need to have the large paste aperature reduced.
U_MAX488 = maxim:MAX488: RS485 TRANSEIVER Source: Data sheet <http://datasheets.maxim-ic.com/en/ds/MAX1487-MAX491.pdf>; MF: MAXIM; MPN: MAX488CSA; OC_FARNELL: 3534170; OC_NEWARK: 34C3921
U_OPTO_1-U_OPTO_3 = Opto-Electronic:MOCD207M: 8- pin SOIC Dual-Channel Phototransistor Output Optocoupler; CATEGORY: Opto-Electronic; MANUFACTURER: ON Semiconductor; MPN: MOCD207M; OPERTAING_TEMP: -40 to +100 °C; PART_STATUS: Active; ROHS_COMPLIANT: RoHS3 Compliant; SUB-CATEGORY: OptoCoupler; THERMALLOSS: 0.24W
U_STM32F779 = stm32f:STM32F77XXX
U_TRACODCDC = traco_thl_tel_series:THL_20WI_SERIES: TRACO POWER DC/DC converter THL 20WI Series created by Mario Blunk - electronics & IT engineering at www.train-z.de; HEAT-SINK: NO
X_DMS X_GPIO X_RXSM-DAPI = con-ept-One27:403-5X020-5X: ept One27 male straight 20pins 1.27 mm pitch SMT Board-to-Board Connector System for parallel, horizontal and perpendicular PCB connections as well as cable-to-board connections. For mezzanine board-to-board connections from 8mm up to 13.8mm. Available with 12 to 80 pins. www.ept.de
X_MIRROR X_MIRROR1 = con-ept-One27:403-5X026-5X: ept One27 male straight 26pins 1.27 mm pitch SMT Board-to-Board Connector System for parallel, horizontal and perpendicular PCB connections as well as cable-to-board connections. For mezzanine board-to-board connections from 8mm up to 13.8mm. Available with 12 to 80 pins. www.ept.de
X_PROG = con-lstb:MA10-2: PIN HEADER; OC_FARNELL: unknown; OC_NEWARK: unknown
X_PT = con-ept-One27:403-5X012-5X: ept One27 male straight 12pins 1.27 mm pitch SMT Board-to-Board Connector System for parallel, horizontal and perpendicular PCB connections as well as cable-to-board connections. For mezzanine board-to-board connections from 8mm up to 13.8mm. Available with 12 to 80 pins. www.ept.de